# EasyEDA Pro project SCH_DRV8701 on Boosted Supply.eprj

# Schematic DRV8701 on Boosted Supply
Create Date: 2023-01-11; Page Name: DRIVIERDRV8701PCB; Project Name: SCH_DRV8701 on Boosted Supply; Schematic Name: DRV8701 on Boosted Supply; Update Date: 2023-01-11; Company: 嘉立创EDA; Page Size: B; Version: V1.0
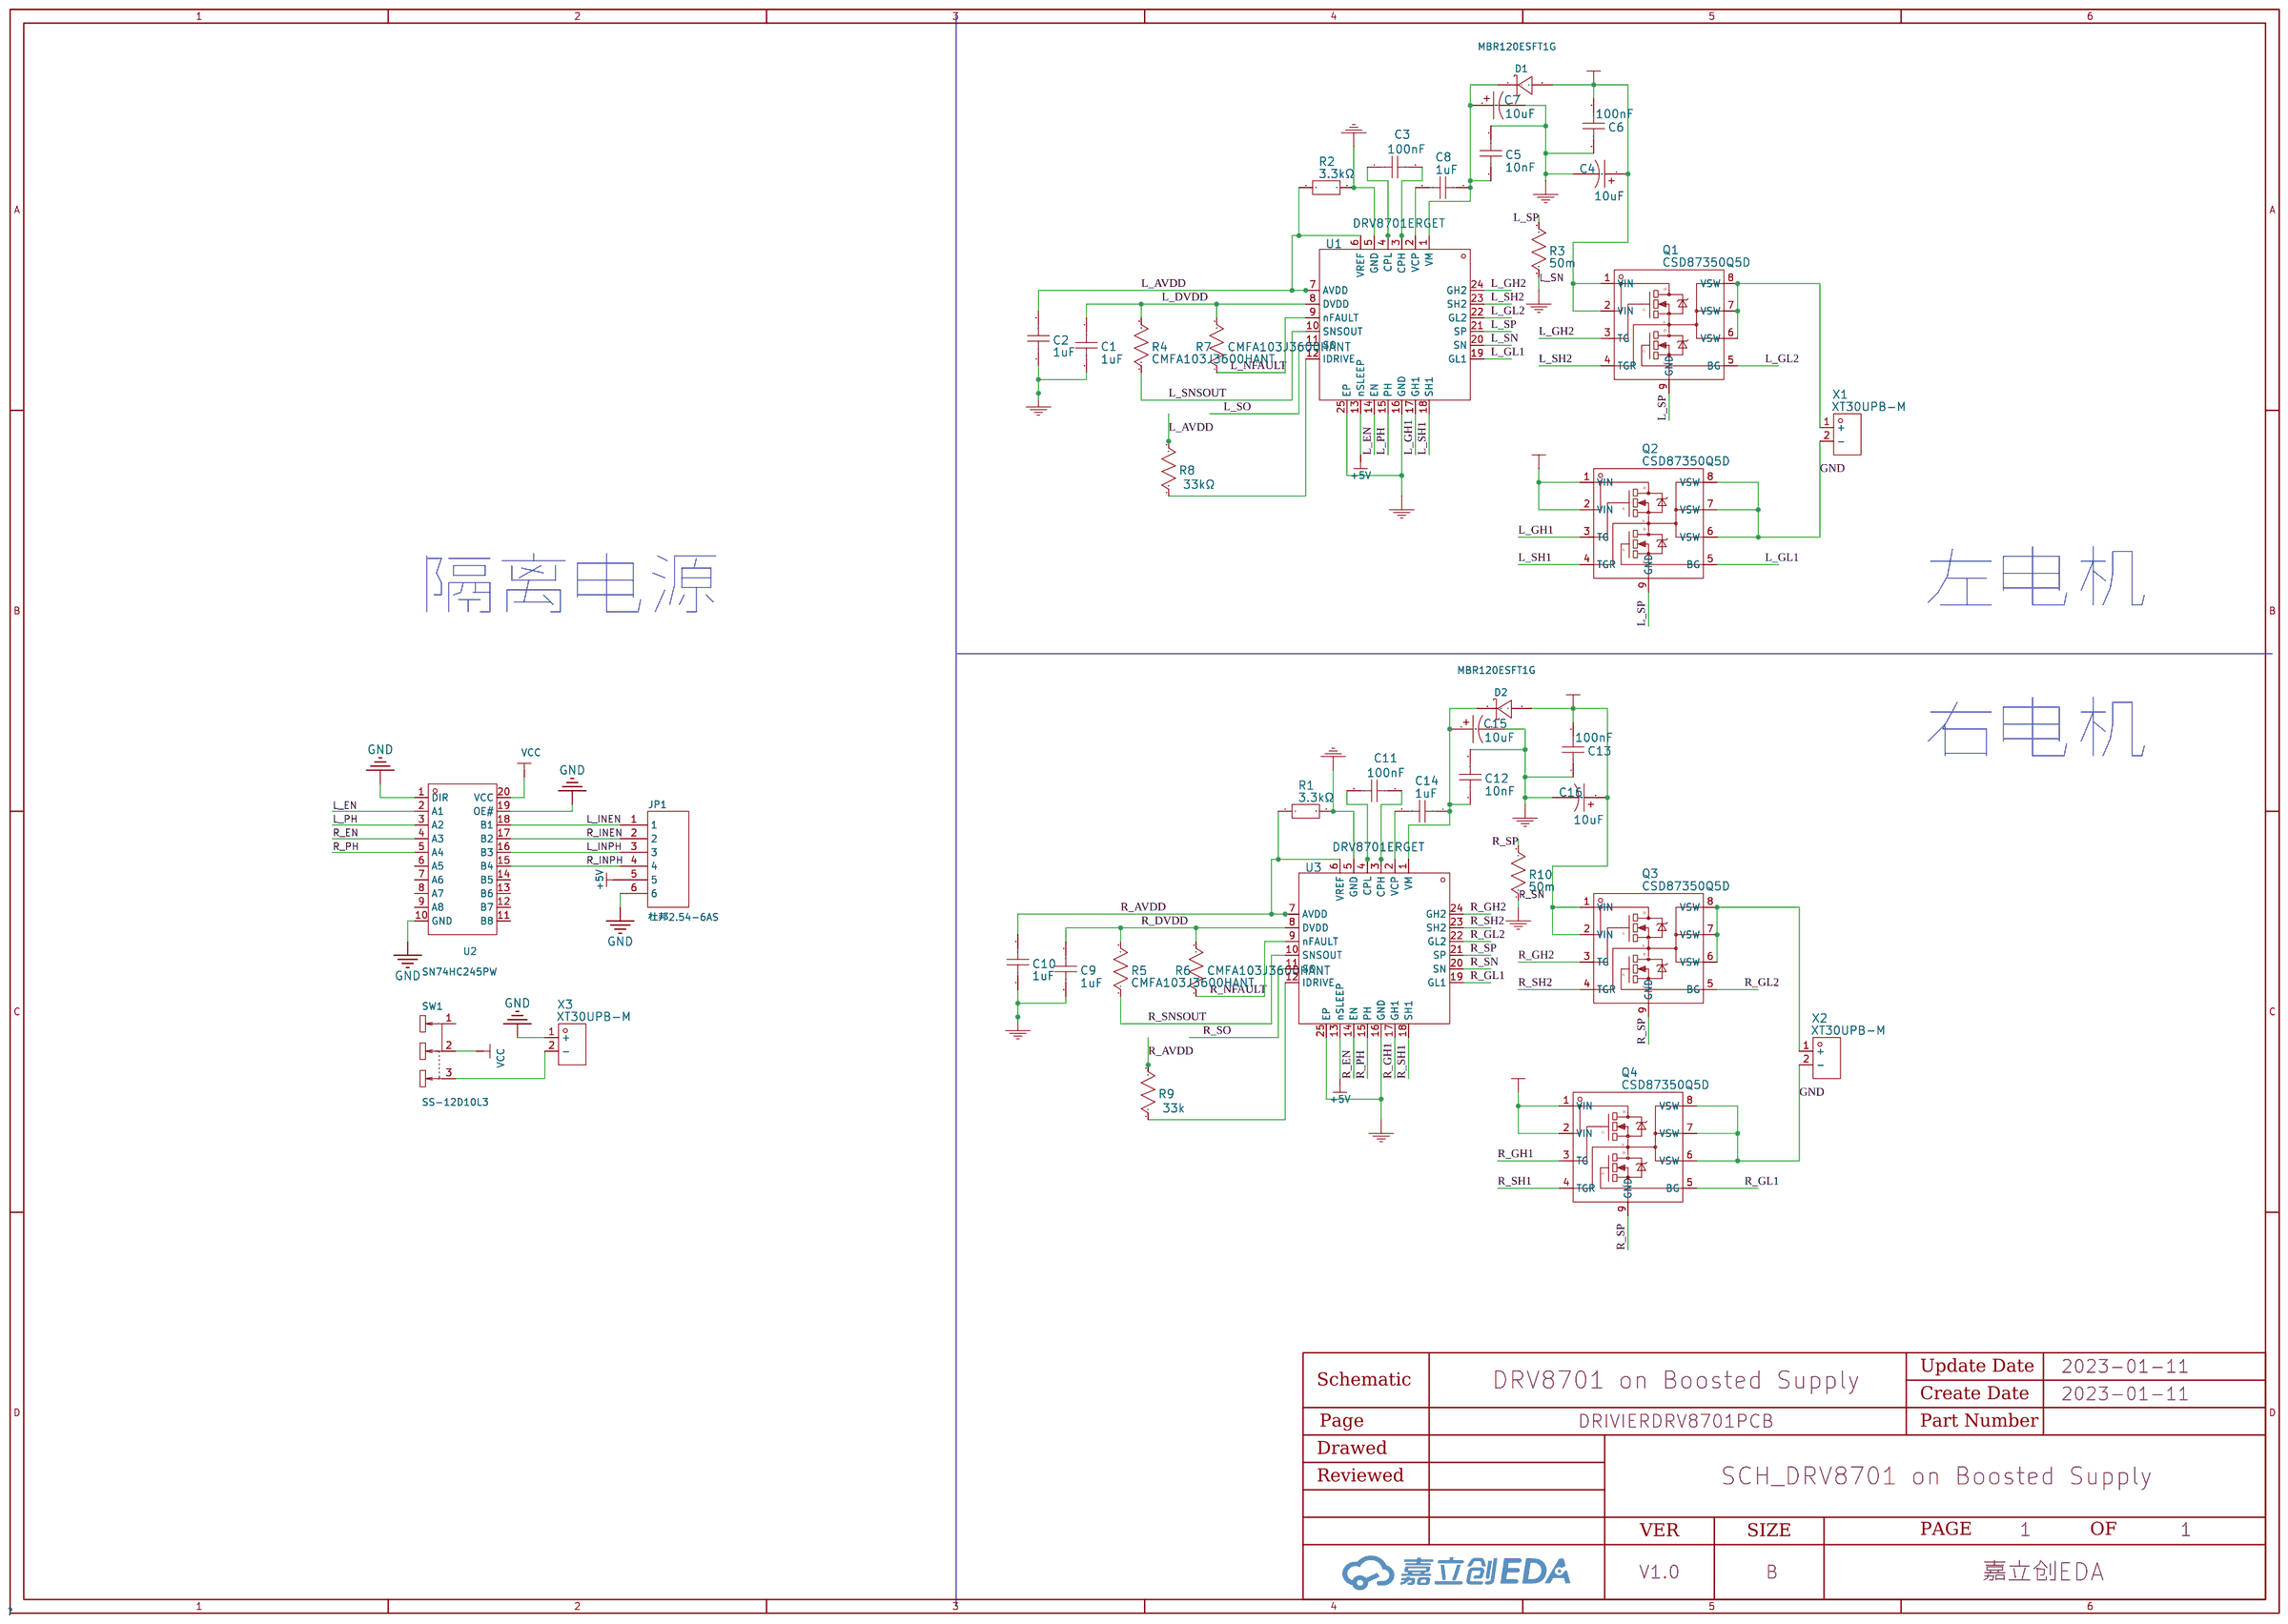
[diagram p0: schematic sheet]

## Parts
C1  1uF  [C0603]
C2  1uF  [C0603]
C3  100nF  [C0603]
C4  10uF  [CAP-TH_BD10.0-P5.00-D0.6-FD]
C5  10nF  [C0603]
C6  100nF  [C0603]
C7  10uF  [CAP-TH_BD10.0-P5.00-D0.6-FD]
C8  1uF  [C0603]
C9  1uF  [C0603]
C10  1uF  [C0603]
C11  100nF  [C0603]
C12  10nF  [C0603]
C13  100nF  [C0603]
C14  1uF  [C0603]
C15  10uF  [CAP-TH_BD10.0-P5.00-D0.6-FD]
C16  10uF  [CAP-TH_BD10.0-P5.00-D0.6-FD]
D1  MBR120ESFT1G  [SOD-123F_L2.7-W1.7-LS3.6-RD]
D2  MBR120ESFT1G  [SOD-123F_L2.7-W1.7-LS3.6-RD]
JP1  杜邦2.54-6AS  [CONN-TH_6P-P2.54_C50130]
Q1  CSD87350Q5D  [LSON-8_L6.0-W5.0-P1.27-LS6.0-TL-EP]
Q2  CSD87350Q5D  [LSON-8_L6.0-W5.0-P1.27-LS6.0-TL-EP]
Q3  CSD87350Q5D  [LSON-8_L6.0-W5.0-P1.27-LS6.0-TL-EP]
Q4  CSD87350Q5D  [LSON-8_L6.0-W5.0-P1.27-LS6.0-TL-EP]
R1  3.3kΩ  [RES-TH_BD4.0-L11.5-P15.50-D0.7]
R2  3.3kΩ  [RES-TH_BD4.0-L11.5-P15.50-D0.7]
R3  50m  [R0603]
R4  CMFA103J3600HANT  [R0603]
R5  CMFA103J3600HANT  [R0603]
R6  CMFA103J3600HANT  [R0603]
R7  CMFA103J3600HANT  [R0603]
R8  33kΩ  [RES-ARRAY-SMD_0804-8P-L2.0-W1.0-BL]
R9  33k  [R0603]
R10  50m  [R0603]
SW1  SS-12D10L3  [SW-TH_SS-12D10L3]
U1  DRV8701ERGET  [VQFN-24_L4.0-W4.0-P0.50-BL-EP2.5]
U2  SN74HC245PW  [TSSOP-20_L6.5-W4.4-P0.65-LS6.4-BL]
U3  DRV8701ERGET  [VQFN-24_L4.0-W4.0-P0.50-BL-EP2.5]
X1  XT30UPB-M  [CONN-TH_XT30UPB-M]
X2  XT30UPB-M  [CONN-TH_XT30UPB-M]
X3  XT30UPB-M  [CONN-TH_XT30UPB-M]

## Library data of the parts
C1 C2 C8-C10 C14 = CC0603KRX5R8BB105: 容值:1uF;精度:±10%;额定电压:25V;材质(温度系数):X5R;; LCSC Part Name: 1uF ±10% 25V; Supplier Part: C14664; Manufacturer: YAGEO(国巨); Supplier Footprint: 0603; JLCPCB Part Class: Extended Part; Datasheet: https://atta.szlcsc.com/upload/public/pdf/source/20160606/1465200209684.pdf; Supplier: LCSC; Tolerance: ±10%; Voltage Rated: 25V; Temperature Coefficient: X5R; Check: true
C3 C6 C11 C13 = CL10B104KB8NNNC: 容值:100nF;精度:±10%;额定电压:50V;材质(温度系数):X7R;; LCSC Part Name: 100nF ±10% 50V; Supplier Part: C1591; Manufacturer: SAMSUNG(三星); Supplier Footprint: 0603; JLCPCB Part Class: Extended Part; Datasheet: https://atta.szlcsc.com/upload/public/pdf/source/20160103/1457707680512.pdf; Supplier: LCSC; Tolerance: ±10%; Voltage Rated: 50V; Temperature Coefficient: X7R; Check: true
C4 C7 C15 C16 = LW100M2501017PV4: 容值:10uF;精度:±20%;额定电压:250V;电容体直径:10mm;电容体长度:20mm;脚间距:5mm;纹波电流:200mA@100kHz;等效串联电阻:4Ω@100kHz;工作寿命:2000hrs@105℃;工作温度:-40℃~+105℃;; LCSC Part Name: 10uF ±20% 250V 停产; Supplier Part: C2847239; Manufacturer: UNITED(怡德); Supplier Footprint: 直插,D10xL20mm; JLCPCB Part Class: Extended Part; Datasheet: https://atta.szlcsc.com/upload/public/pdf/source/20210723/C2847239_147AA3FCC1C7F46DE6816FDB6113BC95.pdf; Supplier: LCSC; Tolerance: ±20%; Rated Voltage: 250V; φD: 10mm; L: 20mm; Lead Spacing: 5mm; Ripple Current: 200mA@100kHz; Equivalent Series Resistance(ESR): 4Ω@100kHz; Lifetime @ Temp: 2000hrs@105℃; Operating Temperature: -40℃~+105℃; Check: true
C5 C12 = CT41G-0603-2X1-25V-0.01μF-K(N): 容值:10nF;精度:±10%;额定电压:25V;材质(温度系数):2X1;; LCSC Part Name: 10nF ±10% 25V; Supplier Part: C141383; Manufacturer: TORCH(火炬); Supplier Footprint: 0603; JLCPCB Part Class: Extended Part; Datasheet: https://atta.szlcsc.com/upload/public/pdf/source/20180326/C141383_03A7B12AFADEEDD421C5B2570CAE3F05.pdf; Supplier: LCSC; Tolerance: ±10%; Voltage Rated: 25V; Temperature Coefficient: 2X1; Check: true
D1 D2 = MBR120ESFT1G: 直流反向耐压(Vr):20V;平均整流电流(Io):1A;正向压降(Vf):530mV@1A;; Supplier Part: C236132; Manufacturer: onsemi(安森美); Supplier Footprint: SOD-123FL; JLCPCB Part Class: Extended Part; Datasheet: https://atta.szlcsc.com/upload/public/pdf/source/20181108/C236132_D79D04B82C34EDF35D87898709B4245F.pdf; Supplier: LCSC; Reverse Voltage (Vr): 20V; Average Rectified Current (Io): 1A; Forward Voltage (Vf@If): 530mV@1A; Check: true
JP1 = 杜邦2.54-6AS: 参考系列:-;间距:2.54mm;插针结构:1x6P;排数:1;每排PIN数:6;行距:-;安装方式:-;触头材质:黄铜;; LCSC Part Name: 2.54mm 1x6P; Supplier Part: C50130; Manufacturer: BOOMELE(博穆精密); Supplier Footprint: 插件,P=2.5mm; JLCPCB Part Class: Extended Part; Datasheet: https://atta.szlcsc.com/upload/public/pdf/source/20151208/1457707616522.pdf; Supplier: LCSC; Pitch: 2.54mm; Pins Structure: 1x6P; Number of Rows: 1; Number of PINs Per Row: 6; Contact Material: 黄铜; Check: true
Q1-Q4 = CSD87350Q5D: 类型:2个N沟道;漏源电压(Vdss):30V;连续漏极电流(Id):40A;功率(Pd):12W;导通电阻(RDS(on)@Vgs,Id):5.9mΩ@8V,20A;阈值电压(Vgs(th)@Id):2.1V@250uA;; LCSC Part Name: 2个N沟道 30V 40A; Supplier Part: C140356; Manufacturer: TI(德州仪器); Supplier Footprint: LSON-8(5x6); JLCPCB Part Class: Extended Part; Datasheet: https://atta.szlcsc.com/upload/public/pdf/source/20180326/C140356_1C911AD09D76D42F5E3D19E3B668112C.pdf; Supplier: LCSC; Type: 2个N沟道; Drain Source Voltage (Vdss): 30V; Continuous Drain Current (Id): 40A; Power Dissipation (Pd): 12W; Drain Source On Resistance (RDS(on)@Vgs,Id): 5.9mΩ@8V,20A; Gate Threshold Voltage (Vgs(th)@Id): 2.1V@250uA; Check: true
R1 R2 = MF1W-3.3KΩ±1% T: 电阻类型:金属膜电阻;阻值:3.3kΩ;精度:±1%;功率:1W;温度系数:±100ppm/℃;最大工作电压:350V;工作温度范围:-55℃~+155℃;; LCSC Part Name: 金属膜电阻 3.3kΩ ±1% 1W; Supplier Part: C119491; Manufacturer: CCO(千志电子); Supplier Footprint: 轴向引线,4.5x11.5mm; JLCPCB Part Class: Extended Part; Datasheet: https://atta.szlcsc.com/upload/public/pdf/source/20170718/C119491_1500346211692823147.pdf; Supplier: LCSC; Type: 金属膜电阻; Tolerance: ±1%; Power(Watts): 1W; Temperature Coefficient: ±100ppm/℃; Overload Voltage (Max): 350V; Operating Temperature Range: -55℃~+155℃; Check: true
R3 R10 = 50m: Check: false
R4-R7 = CMFA103J3600HANT: LCSC Part Name: 10kΩ ±5%; Supplier Part: C2976753; Manufacturer: FH(风华); Supplier Footprint: 0603; JLCPCB Part Class: Extended Part; Datasheet: https://atta.szlcsc.com/upload/public/pdf/source/20210728/C107464_1EC5A9420957424CF6525879D73B8579.pdf; Supplier: LCSC; Check: true
R8 = CAT10-333J4LF: 阻值:33kΩ;精度:±5%;单个元件功率:62.5mW;温度系数:±250ppm/℃;电阻器数:4;引脚数:8;; LCSC Part Name: 33kΩ ±5%; Supplier Part: C148516; Manufacturer: BOURNS; Supplier Footprint: 0402x4; JLCPCB Part Class: Extended Part; Datasheet: https://atta.szlcsc.com/upload/public/pdf/source/20171120/C148516_15111593514721130549.pdf; Supplier: LCSC; Tolerance: ±5%; Power(Watts): 62.5mW; Temperature Coefficient: ±250ppm/℃; Number of Resistors: 4; Number of Pins: 8; Check: true
R9 = 68k: Check: false
SW1 = SS-12D10L3: 额定电流(DC):3A;额定电压(DC):125V;额定电流(AC):3A;额定电压(AC):125V;电路结构:单刀双掷;安装方式:直插;机械寿命:10000;开关颜色:黑色;滑钮形状:矩形柱状;引脚样式:PC引脚;工作温度:-40℃~+85℃;开关长度:13mm;开关宽度:6.8mm;开关高度:6.4mm;; LCSC Part Name: 插件大电流拨动开关; Supplier Part: C319013; Manufacturer: XKB Connectivity(中国星坤); Supplier Footprint: 插件; JLCPCB Part Class: Extended Part; Datasheet: https://atta.szlcsc.com/upload/public/pdf/source/20211009/D6412F37AABE6F9459A6EE7FA4DAEADB.pdf; Supplier: LCSC; Current Rating (DC): 3A; Voltage Rating (DC): 125V; Current Rating (AC): 3A; Voltage Rating (AC): 125V; Circuit: 单刀双掷; Mounting Style: 直插; Mechanical Life: 10000; Actuator Color: 黑色; Actuator Style: 矩形柱状; Pin Style: PC引脚; Operating Temperature: -40℃~+85℃; Switch Length: 13mm; Switch Width: 6.8mm; Switch Height: 6.4mm; Check: true
U1 U3 = DRV8701ERGET: 电源电压:0V~5.5V;输出电流:-;接口:并行;; Supplier Part: C132049; Manufacturer: TI(德州仪器); Supplier Footprint: VQFN-24(4x4); JLCPCB Part Class: Extended Part; Datasheet: https://atta.szlcsc.com/upload/public/pdf/source/20170925/C132049_1506321643935990409.pdf; Supplier: LCSC; Type: 有刷直流电机; Supply Voltage: 0V~5.5V; Interface: 并行; Operating Temperature: -40℃~+125℃@(Ta); Check: true
U2 = SN74HC245PW: 具有三态输出的八路总线收发器 20-TSSOP -40 to 85; Supplier Part: C2871191; Manufacturer: TI(德州仪器); Supplier Footprint: TSSOP-20; JLCPCB Part Class: Extended Part; Supplier: LCSC; Check: true
X1-X3 = XT30UPB-M: Supplier Part: C428721; Manufacturer: AMASS(艾迈斯); JLCPCB Part Class: Extended Part; Datasheet: https://atta.szlcsc.com/upload/public/pdf/source/20190916/C428721_B0ECB8C5937139CEFE8736D2D3175B0E.pdf; Supplier: LCSC; link: https://item.szlcsc.com/100315.html; Check: true

## Nets
+5V: JP1.5 U1.13(nSLEEP) U3.13(nSLEEP)
GND: C1.2 C2.1 C4.2 C5.2 C6.1 C7.2 C9.2 C10.1 C12.2 C13.1 C15.2 C16.2 JP1.6 Q2.6(VSW) Q2.7(VSW) Q2.8(VSW) Q4.6(VSW) Q4.7(VSW) Q4.8(VSW) R1.2 R2.2 U1.5(GND) U1.16(GND) U1.25(EP) U2.1(DIR) U2.10(GND) U2.19(OE#) U3.5(GND) U3.16(GND) U3.25(EP) X1.2(-) X2.2(-) X3.1(+)
VBAT: C4.1 C6.2 C13.2 C16.1 D1.2(A) D2.2(A) Q1.1(VIN) Q1.2(VIN) Q2.1(VIN) Q2.2(VIN) Q3.1(VIN) Q3.2(VIN) Q4.1(VIN) Q4.2(VIN)
VCC: SW1.2 U2.20(VCC)
L_AVDD: C2.2 R2.1 R8.2 U1.6(VREF) U1.7(AVDD)
L_DVDD: C1.1 R4.2 R7.2 U1.8(DVDD)
L_EN: U1.14(EN) U2.2(A1)
L_GH1: Q2.3(TG) U1.17(GH1)
L_GH2: Q1.3(TG) U1.24(GH2)
L_GL1: Q2.5(BG) U1.19(GL1)
L_GL2: Q1.5(BG) U1.22(GL2)
L_INEN: JP1.1 U2.18(B1)
L_INPH: JP1.3 U2.16(B3)
L_NFAULT: R7.1 U1.9(nFAULT)
L_PH: U1.15(PH) U2.3(A2)
L_SH1: Q2.4(TGR) U1.18(SH1)
L_SH2: Q1.4(TGR) U1.23(SH2)
L_SN: R3.1 U1.20(SN)
L_SNSOUT: R4.1 U1.10(SNSOUT)
L_SO: U1.11(SO)
L_SP: Q1.9(GND) Q2.9(GND) R3.2 U1.21(SP)
R_AVDD: C10.2 R1.1 R9.2 U3.6(VREF) U3.7(AVDD)
R_DVDD: C9.1 R5.2 R6.2 U3.8(DVDD)
R_EN: U2.4(A3) U3.14(EN)
R_GH1: Q4.3(TG) U3.17(GH1)
R_GH2: Q3.3(TG) U3.24(GH2)
R_GL1: Q4.5(BG) U3.19(GL1)
R_GL2: Q3.5(BG) U3.22(GL2)
R_INEN: JP1.2 U2.17(B2)
R_INPH: JP1.4 U2.15(B4)
R_NFAULT: R6.1 U3.9(nFAULT)
R_PH: U2.5(A4) U3.15(PH)
R_SH1: Q4.4(TGR) U3.18(SH1)
R_SH2: Q3.4(TGR) U3.23(SH2)
R_SN: R10.1 U3.20(SN)
R_SNSOUT: R5.1 U3.10(SNSOUT)
R_SO: U3.11(SO)
R_SP: Q3.9(GND) Q4.9(GND) R10.2 U3.21(SP)
$1N94: C3.1 U1.4(CPL)
$1N95: C3.2 U1.3(CPH)
$1N105: C8.2 U1.2(VCP)
$1N139: R8.1 U1.12(IDRIVE)
$1N238: Q1.6(VSW) Q1.7(VSW) Q1.8(VSW) X1.1(+)
$1N2225: C5.1 C7.1 C8.1 D1.1(K) U1.1(VM)
$1N6642: R9.1 U3.12(IDRIVE)
$1N6643: C14.2 U3.2(VCP)
$1N6644: C11.1 U3.4(CPL)
$1N6647: C12.1 C14.1 C15.1 D2.1(K) U3.1(VM)
$1N6664: C11.2 U3.3(CPH)
$1N6665: Q3.6(VSW) Q3.7(VSW) Q3.8(VSW) X2.1(+)
$1N13007: SW1.3 X3.2(-)

Not connected (* = marked no-connect by the designer): SW1 1; U2 6(A5) 7(A6) 8(A7) 9(A8) 11(B8) 12(B7) 13(B6) 14(B5)

## Notes on the sheet
- 左电机
- 隔离电源
- 右电机

# Schematic DRV8701 on Boosted Supply_1
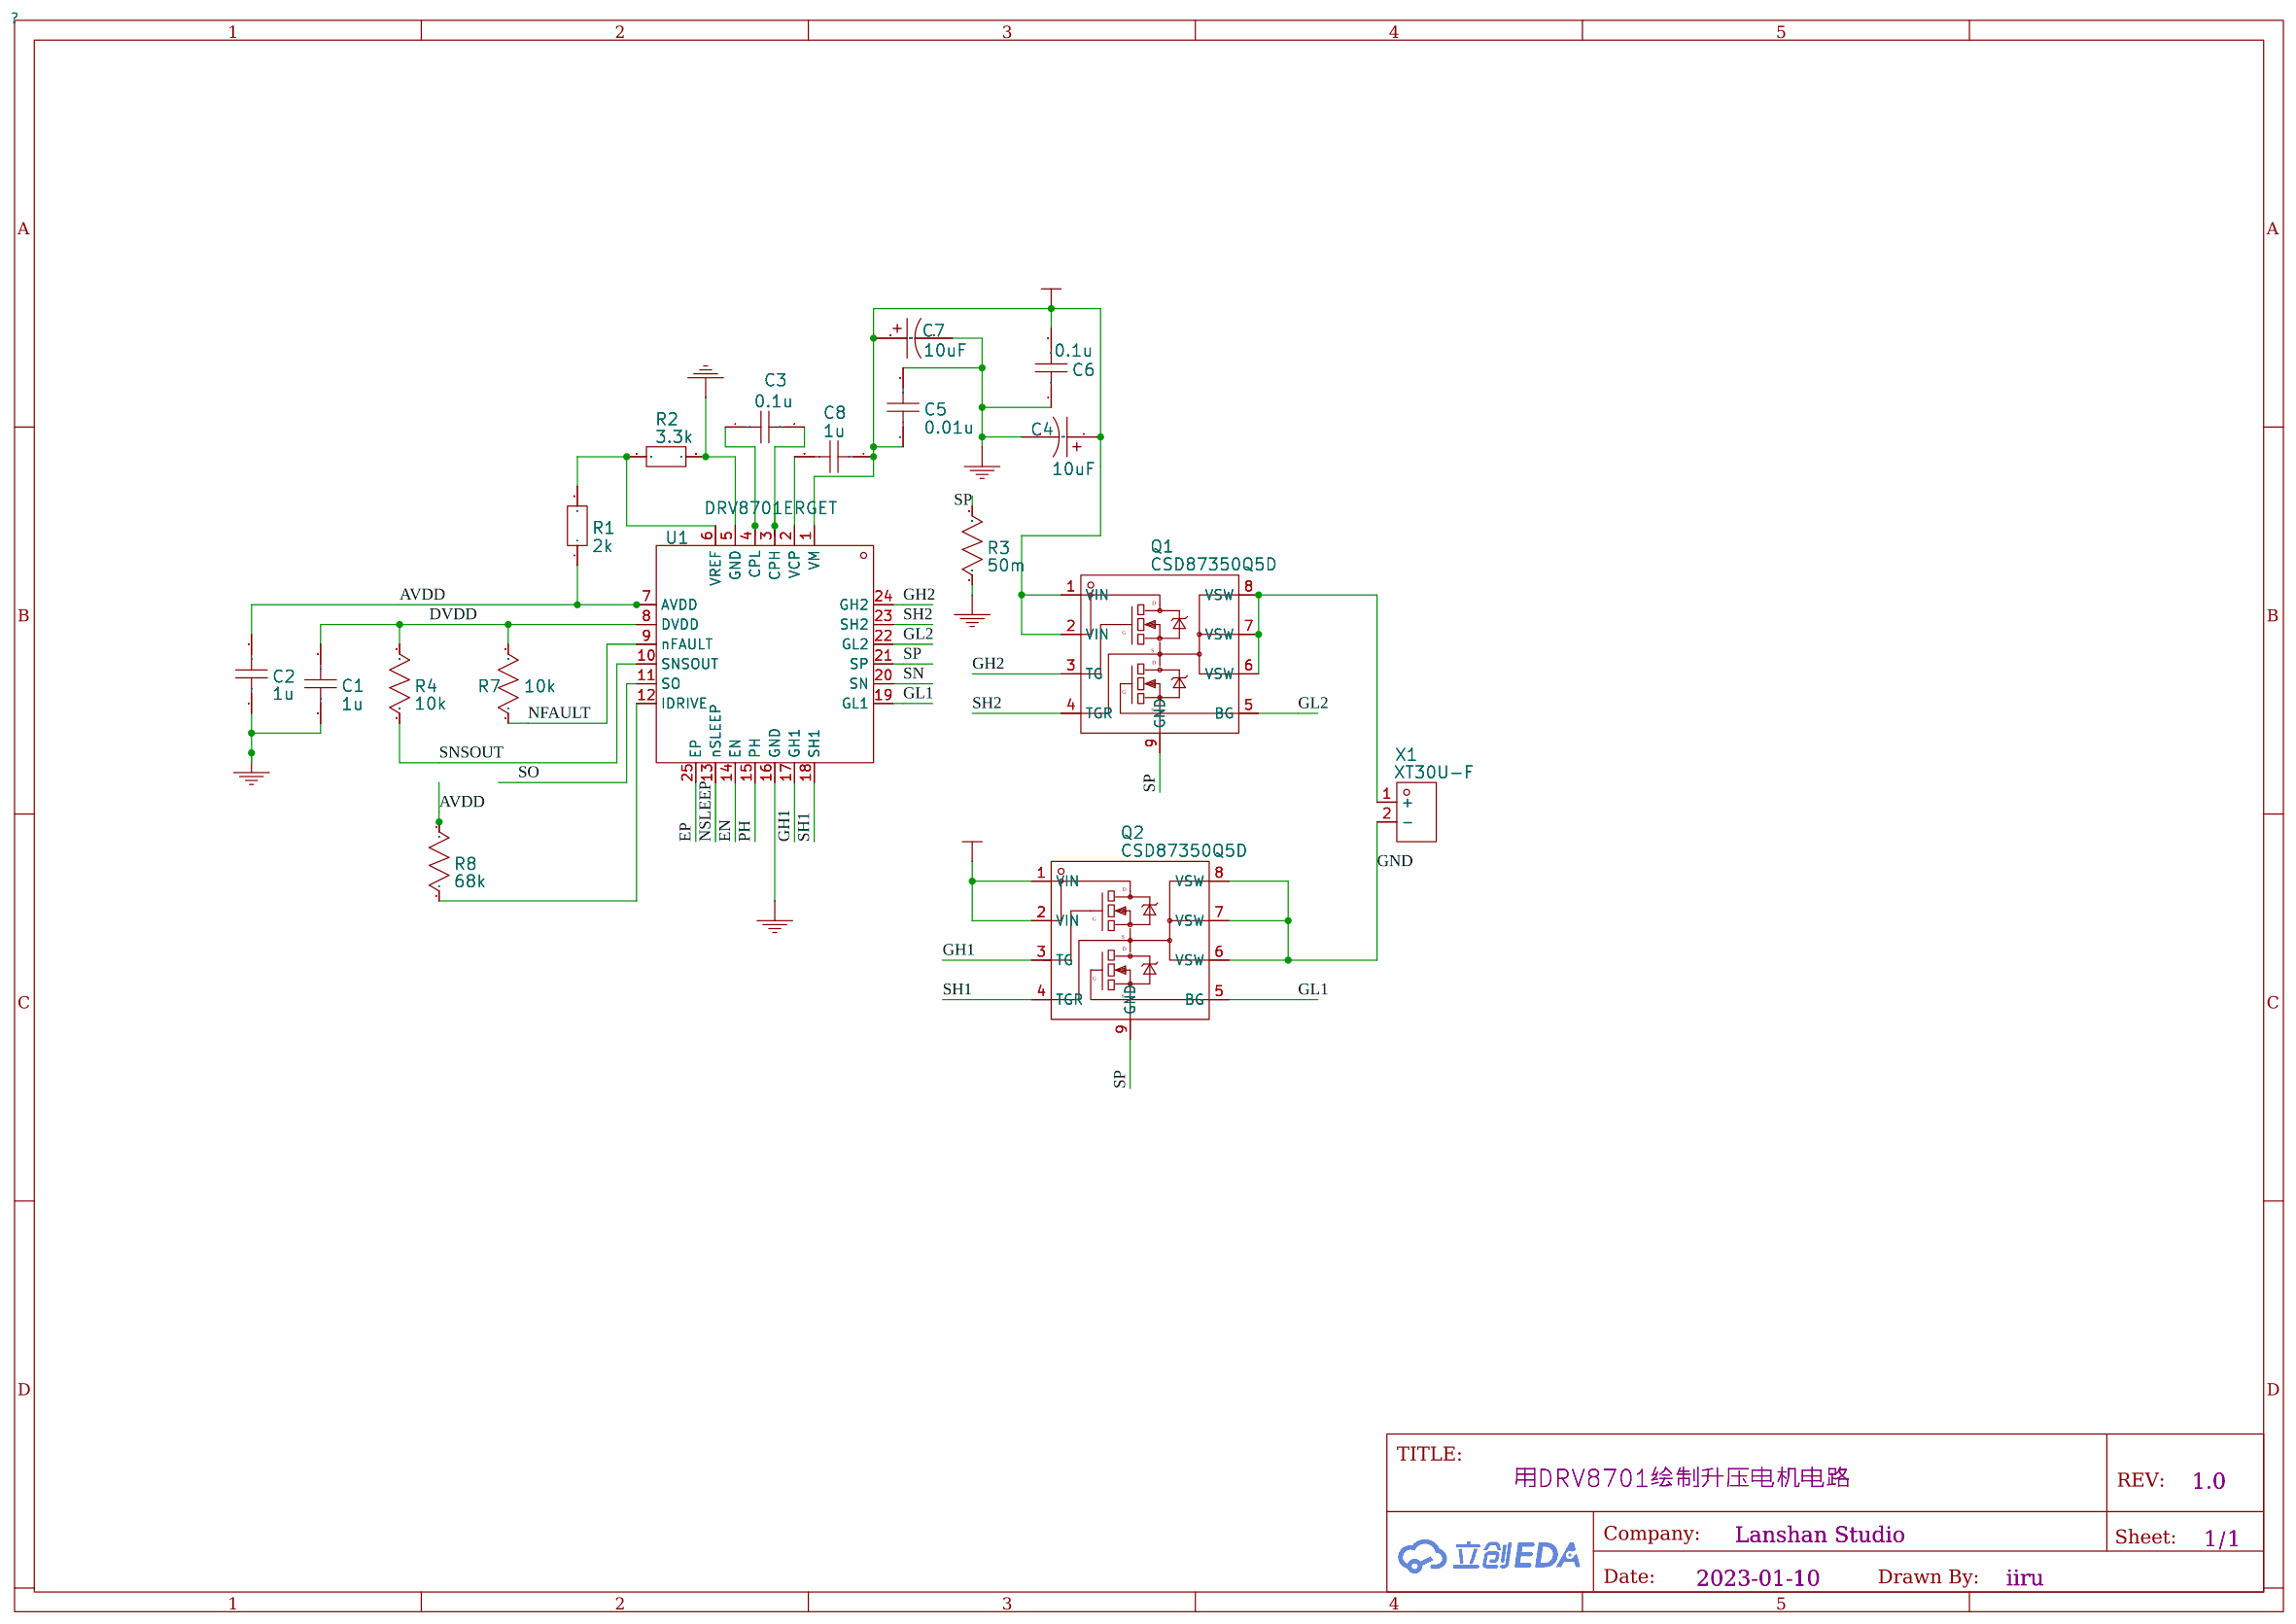
[diagram p1: schematic sheet]

## Parts
C1  1u
C2  1u
C3  0.1u
C4  10uF
C5  0.01u
C6  0.1u
C7  10uF
C8  1u
Q1  CSD87350Q5D
Q2  CSD87350Q5D
R1  2k
R2  3.3k
R3  50m
R4  10k
R7  10k
R8  68k
U1  DRV8701ERGET
X1  XT30U-F

## Library data of the parts
C1 C2 C8 = 1u
C3 C6 = 0.1u
C4 C7 = 10uF
C5 = 0.01u
Q1 Q2 = CSD87350Q5D: Supplier: LCSC; Supplier Part: C140356; Manufacturer: TI(德州仪器); JLCPCB Part Class: Extended Part
R1 = 2k
R2 = 3.3k
R3 = 50m
R4 R7 = 10k
R8 = 68k
U1 = DRV8701ERGET: Supplier: LCSC; Manufacturer: TI(德州仪器); Supplier Part: C132049; JLCPCB Part Class: Extended Part
X1 = XT30U-F: Manufacturer: AMASS(艾迈斯); Supplier Part: C99102; Supplier: LCSC; link: https://item.szlcsc.com/100315.html

## Nets
AVDD: C2.2 R1.1 R8.2 U1.7(AVDD)
DVDD: C1.1 R4.2 R7.2 U1.8(DVDD)
GND: C1.2 C2.1 C4.2 C5.2 C6.1 C7.2 Q2.6(VSW) Q2.7(VSW) Q2.8(VSW) R2.2 R3.1 U1.5(GND) U1.16(GND) X1.2(-)
VBAT: C4.1 C5.1 C6.2 C7.1 C8.1 Q1.1(VIN) Q1.2(VIN) Q2.1(VIN) Q2.2(VIN) U1.1(VM)
EN: U1.14(EN)
EP: U1.25(EP)
GH1: Q2.3(TG) U1.17(GH1)
GH2: Q1.3(TG) U1.24(GH2)
GL1: Q2.5(BG) U1.19(GL1)
GL2: Q1.5(BG) U1.22(GL2)
NFAULT: R7.1 U1.9(nFAULT)
NSLEEP: U1.13(nSLEEP)
PH: U1.15(PH)
SH1: Q2.4(TGR) U1.18(SH1)
SH2: Q1.4(TGR) U1.23(SH2)
SN: U1.20(SN)
SNSOUT: R4.1 U1.10(SNSOUT)
SO: U1.11(SO)
SP: Q1.9(GND) Q2.9(GND) R3.2 U1.21(SP)
Net-(C3-1): C3.1 U1.4(CPL)
Net-(C3-2): C3.2 U1.3(CPH)
Net-(C8-2): C8.2 U1.2(VCP)
Net-(Q1-6): Q1.6(VSW) Q1.7(VSW) Q1.8(VSW) X1.1(+)
Net-(R1-2): R1.2 R2.1 U1.6(VREF)
Net-(R8-1): R8.1 U1.12(IDRIVE)

# Board PCB1
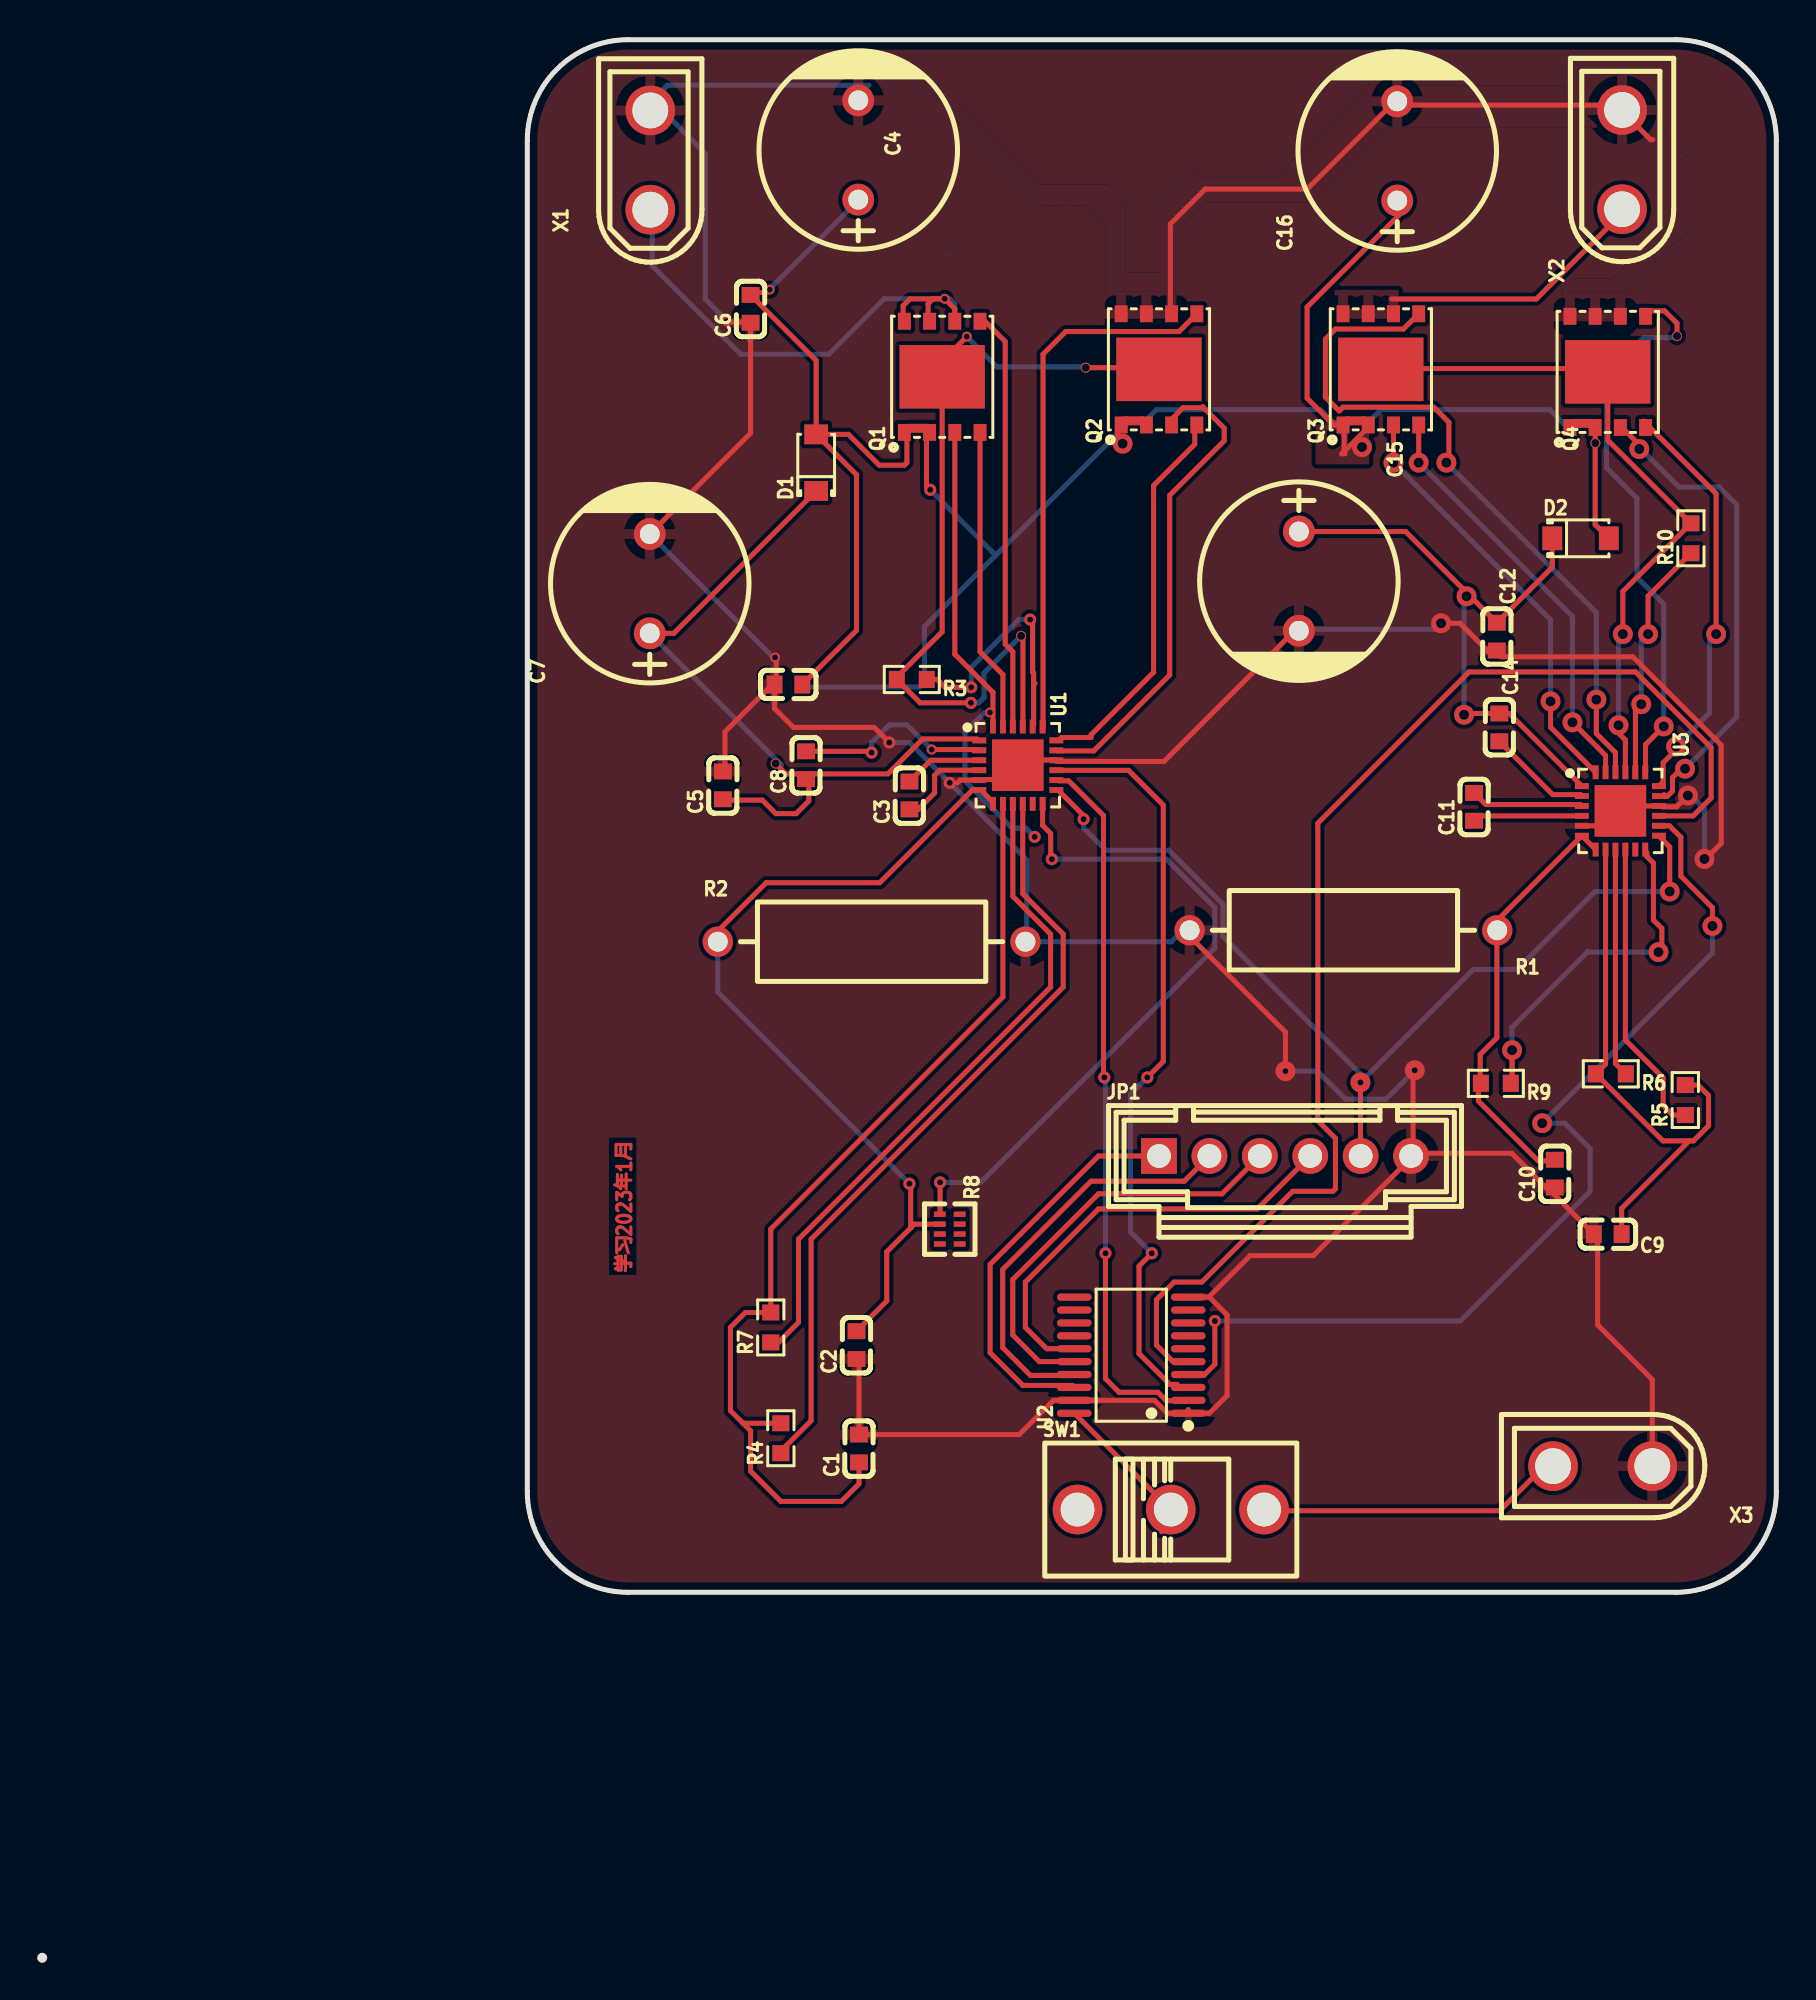
[diagram p2: board, top side]
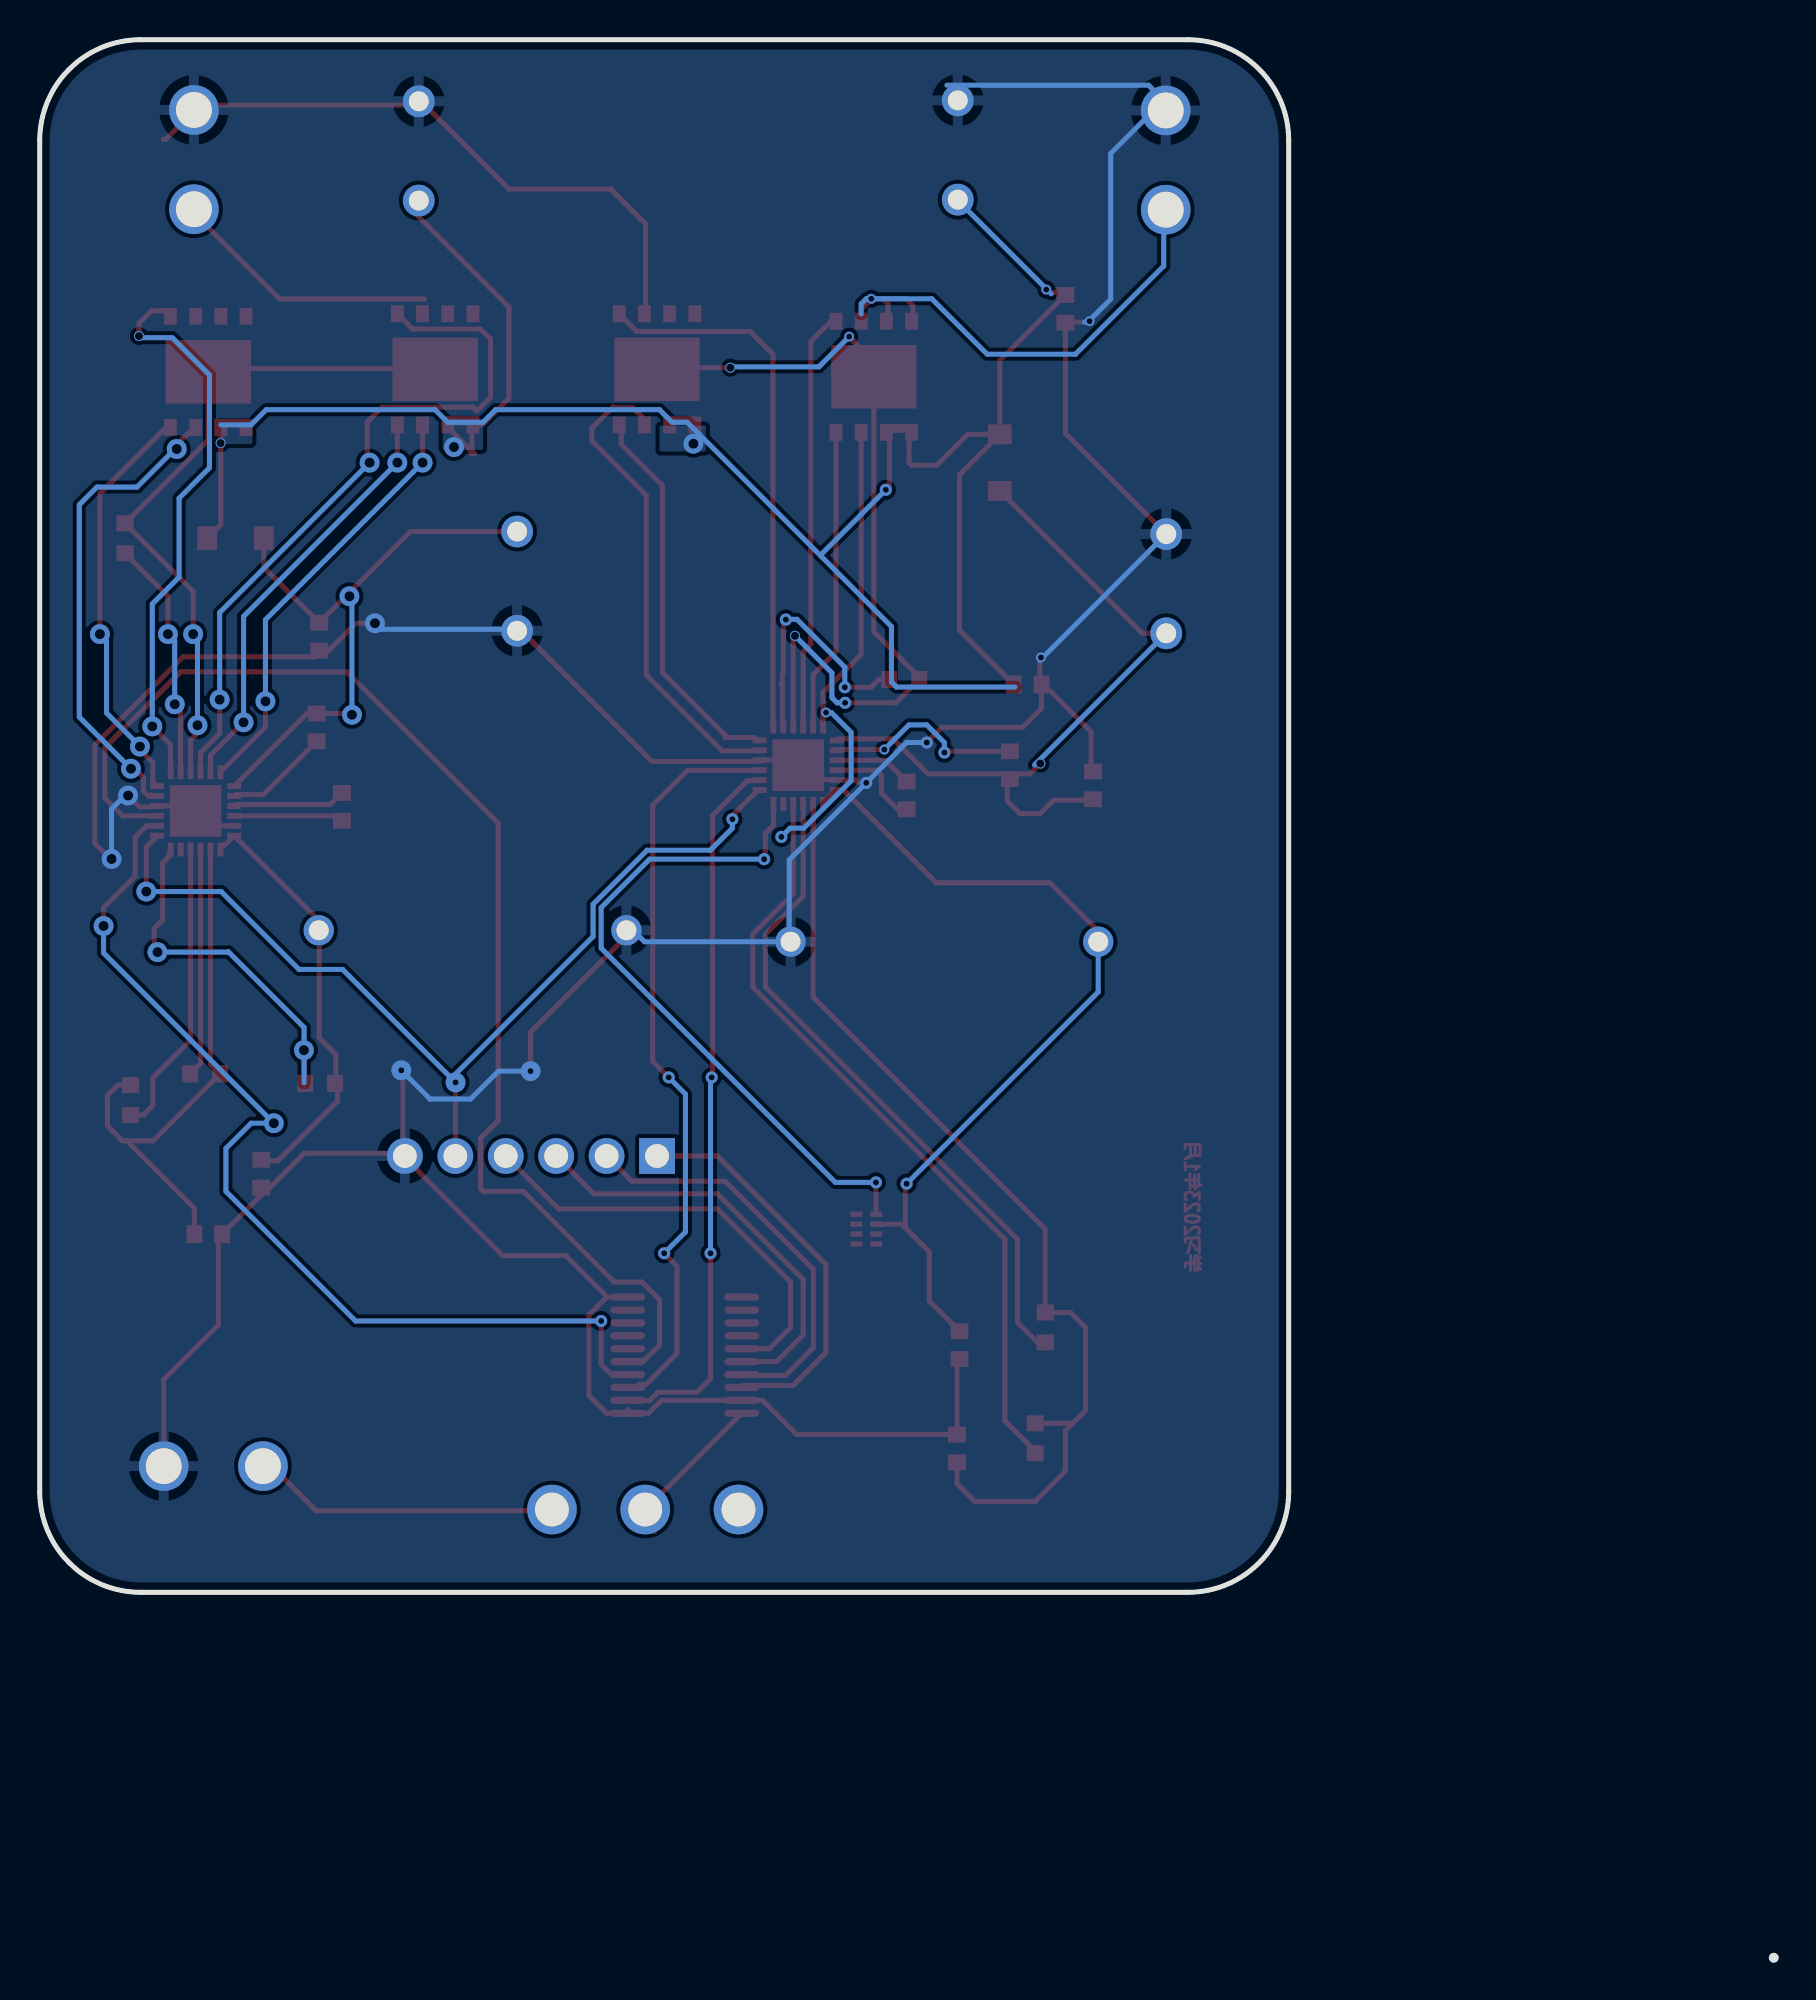
[diagram p3: board, bottom side, seen from below]

Outline 87.49 x 96.74 mm; copper layers: Top Layer, Bottom Layer. Coordinates in mm from the lower left corner of the outline.
Outline path: circle c0.13,0.13 r0.13 ; 24.56,91.66 arc(26.05,95.25) 29.64,96.74 82.41,96.74 arc(86,95.25) 87.49,91.66 87.49,23.62 arc(86,20.02) 82.41,18.54 29.64,18.54 arc(26.05,20.02) 24.56,23.62 24.56,91.66
Stack: Top Layer 0.035mm / Dielectric1 1.51mm FR4 er 4.5 / Bottom Layer 0.035mm

## Design rules (mm)
spacing safeClearance (default): track to track 0.152, other pairs 0.152 to 0.3
track width trackWidth (default): min 0.127, default 0.254, max 2.54
differential pair differentialPair (default): width min 0.127, default 0.254, max 2.54; gap min 0.152, default 0.152
via viaSize (default): diameter min 0.5, default 0.61, max 10; hole min 0.3, default 0.305, max 6

## Placement (name value [footprint] x y rotation side)
C1  1uF  [C0603]  41.27 25.78 90 top
C2  1uF  [C0603]  41.15 30.99 90 top
C3  100nF  [C0603]  43.81 58.67 90 top
C4  10uF  [CAP-TH_BD10.0-P5.00-D0.6-FD]  41.24 91.19 90 top
C5  10nF  [C0603]  34.42 59.18 90 top
C6  100nF  [C0603]  35.81 83.18 90 top
C7  10uF  [CAP-TH_BD10.0-P5.00-D0.6-FD]  30.73 69.34 90 top
C8  1uF  [C0603]  38.61 60.2 90 top
C9  1uF  [C0603]  78.99 36.58 180 top
C10  1uF  [C0603]  76.33 39.62 90 top
C11  100nF  [C0603]  72.26 58.1 90 top
C12  10nF  [C0603]  73.41 66.67 270 top
C13  100nF  [C0603]  37.72 64.26 0 top
C14  1uF  [C0603]  73.53 62.1 270 top
C15  10uF  [CAP-TH_BD10.0-P5.00-D0.6-FD]  63.43 69.47 270 top
C16  10uF  [CAP-TH_BD10.0-P5.00-D0.6-FD]  68.39 91.14 90 top
D1  MBR120ESFT1G  [SOD-123F_L2.7-W1.7-LS3.6-RD]  39.12 75.44 90 top
D2  MBR120ESFT1G  [SOD-123F_L2.7-W1.7-LS3.6-RD]  77.62 71.63 0 top
JP1  杜邦2.54-6AS  [CONN-TH_6P-P2.54_C50130]  62.74 40.51 0 top
Q1  CSD87350Q5D  [LSON-8_L6.0-W5.0-P1.27-LS6.0-TL-EP]  45.47 79.76 90 top
Q2  CSD87350Q5D  [LSON-8_L6.0-W5.0-P1.27-LS6.0-TL-EP]  56.39 80.14 90 top
Q3  CSD87350Q5D  [LSON-8_L6.0-W5.0-P1.27-LS6.0-TL-EP]  67.57 80.14 90 top
Q4  CSD87350Q5D  [LSON-8_L6.0-W5.0-P1.27-LS6.0-TL-EP]  79 80.01 90 top
R1  3.3kΩ  [RES-TH_BD4.0-L11.5-P15.50-D0.7]  65.68 51.88 180 top
R2  3.3kΩ  [RES-TH_BD4.0-L11.5-P15.50-D0.7]  41.91 51.31 0 top
R3  50m  [R0603]  43.93 64.52 180 top
R4  CMFA103J3600HANT  [R0603]  37.34 26.3 90 top
R5  CMFA103J3600HANT  [R0603]  82.9 43.33 90 top
R6  CMFA103J3600HANT  [R0603]  79.15 44.65 180 top
R7  CMFA103J3600HANT  [R0603]  36.83 31.88 90 top
R8  33kΩ  [RES-ARRAY-SMD_0804-8P-L2.0-W1.0-BL]  45.85 36.83 270 top
R9  33k  [R0603]  73.36 44.17 180 top
R10  50m  [R0603]  83.18 71.63 90 top
SW1  SS-12D10L3  [SW-TH_SS-12D10L3]  56.98 22.7 0 top
U1  DRV8701ERGET  [VQFN-24_L4.0-W4.0-P0.50-BL-EP2.5]  49.27 60.2 270 top
U2  SN74HC245PW  [TSSOP-20_L6.5-W4.4-P0.65-LS6.4-BL]  54.99 30.48 90 top
U3  DRV8701ERGET  [VQFN-24_L4.0-W4.0-P0.50-BL-EP2.5]  79.63 57.89 270 top
X1  XT30UPB-M  [CONN-TH_XT30UPB-M]  30.76 90.68 90 top
X2  XT30UPB-M  [CONN-TH_XT30UPB-M]  79.72 90.7 90 top
X3  XT30UPB-M  [CONN-TH_XT30UPB-M]  78.74 24.89 180 top

## Footprints (pads in the part's own frame, mm; a bottom-side part is the same pattern mirrored in y, then rotated)
C0603
  rect 0.8x0.9 smd: 1(-0.7,0) 2(0.7,0)
CAP-TH_BD10.0-P5.00-D0.6-FD
  round 1.6 hole 1: 1(-2.5,0) 2(2.5,0)
CONN-TH_6P-P2.54_C50130
  rect 1.801x1.801 hole 1.199: 1(-6.35,0)
  round 1.801 hole 1.199: 2(-3.81,0) 3(-1.27,0) 4(1.27,0) 5(3.81,0) 6(6.35,0)
CONN-TH_XT30UPB-M
  round 2.499 hole 1.801: 1(-2.499,0) 2(2.499,0)
LSON-8_L6.0-W5.0-P1.27-LS6.0-TL-EP
  rect 0.85x0.65 smd: 1(-2.8,1.905) 2(-2.8,0.635) 3(-2.8,-0.635) 4(-2.8,-1.905) 5(2.8,-1.905) 6(2.8,-0.635) 7(2.8,0.635) 8(2.8,1.905)
  rect 0.45x1 smd: 1(-2.594,1.27)
  rect 3.2x4.3 smd: 9(0,0.002)
R0603
  rect 0.806x0.864 smd: 1(-0.753,0) 2(0.753,0)
RES-ARRAY-SMD_0804-8P-L2.0-W1.0-BL
  rect 0.275x0.6 smd: 1(-0.75,-0.5) 2(-0.249,-0.5) 3(0.249,-0.5) 4(0.75,-0.5) 5(0.75,0.5) 6(0.249,0.5) 7(-0.249,0.5) 8(-0.75,0.5)
RES-TH_BD4.0-L11.5-P15.50-D0.7
  round 1.524 hole 1.001: 1(-7.75,0) 2(7.75,0)
SOD-123F_L2.7-W1.7-LS3.6-RD
  rect 1.001x1.199 smd: 1(-1.425,0) 2(1.425,0)
SW-TH_SS-12D10L3
  round 2.499 hole 1.7: 1(-4.699,0) 2(0,0) 3(4.699,0)
TSSOP-20_L6.5-W4.4-P0.65-LS6.4-BL
  oval 0.364x1.742 smd: 1(-2.925,-2.871) 2(-2.275,-2.871) 3(-1.625,-2.871) 4(-0.975,-2.871) 5(-0.325,-2.871) 6(0.325,-2.871) 7(0.975,-2.871) 8(1.625,-2.871) 9(2.275,-2.871) 10(2.925,-2.871) 11(2.925,2.871) 12(2.275,2.871) 13(1.625,2.871) 14(0.975,2.871) 15(0.325,2.871) 16(-0.325,2.871) 17(-0.975,2.871) 18(-1.625,2.871) 19(-2.275,2.871) 20(-2.925,2.871)
VQFN-24_L4.0-W4.0-P0.50-BL-EP2.5
  rect 0.3x0.7 smd: 1(-1.25,-1.942) 2(-0.75,-1.942) 3(-0.25,-1.942) 4(0.25,-1.942) 5(0.75,-1.942) 6(1.25,-1.942) 13(1.25,1.942) 14(0.75,1.942) 15(0.25,1.942) 16(-0.25,1.942) 17(-0.75,1.942) 18(-1.25,1.942)
  rect 0.7x0.3 smd: 7(1.948,-1.25) 8(1.948,-0.75) 9(1.948,-0.25) 10(1.948,0.25) 11(1.948,0.75) 12(1.948,1.25) 19(-1.948,1.25) 20(-1.948,0.75) 21(-1.948,0.25) 22(-1.948,-0.25) 23(-1.948,-0.75) 24(-1.948,-1.25)
  rect 2.6x2.6 smd: 25(0.001,-0.001)

## Nets
As in the schematic.

Pads without a net: R8 3 4 5 6 7 8; SW1 1; U2 6 7 8 9 11 12 13 14

## Via types
v1: diameter 0.5, hole 0.3, Top Layer to Bottom Layer, 6 vias
v2: diameter 1.001, hole 0.305, Top Layer to Bottom Layer, 2 vias
v3: diameter 1.001, hole 0.508, Top Layer to Bottom Layer, 27 vias
v4: diameter 1.001, hole 0.3, Top Layer to Bottom Layer, 1 via
v5: diameter 0.61, hole 0.305, Top Layer to Bottom Layer, 17 vias
v6: diameter 0.508, hole 0.406, Top Layer to Bottom Layer, 5 vias
v7: diameter 0.508, hole 0.305, Top Layer to Bottom Layer, 1 via

## Routing (per net, layer and track width the routed paths; a pad name or vN(x,y) marks a point on that pad's centre or on a via; arc(x,y) is an arc through that point)
+5V: length 48.6
  Top Layer w0.254: v2(66.54,44.22) 66.54,40.64 66.46,40.56 ; 51.39,58.86 52.59,57.66 v5(52.59,57.48) ; 81.67,56.53 82.12,56.08 v3(82.12,53.83)
  Bottom Layer w0.254: v3(82.12,53.83) 78.34,53.83 74.42,49.91 72.23,49.91 v2(66.54,44.22) ; v5(52.59,57.48) 52.59,57.03 53.7,55.91 56.89,55.91 59.61,53.19 59.61,51.57 66.62,44.55
GND: length 261.3
  Top Layer w0.254: 81.75,58.1 82.46,58.1 v3(83.03,58.67) ; U3.16 79.88,58.14 U3.25 78.88,57.14 U3.5 ; U2.1 58.92,27.55 59.82,28.45 59.82,32.51 58.92,33.4 U2.10 ; U2.1 56.81,27.55 56.16,28.2 U2.19 51.07,28.2 49.35,26.48 C1.2 41.27,30.16 C2.1 ; U2.1 57.86,27.74 ; U1.5 46.37,59.45 46.23,59.31 ; 47.51,59.48 48.59,59.48 49.34,60.22 ; 49.63,60.28 50.33,60.28 50.52,60.46 51.19,60.46 51.2,60.45 ; 35.82,82.52 34.65,82.52 v1(34.6,82.57) ; C7.2 35.81,76.92 C6.1 ; 37.1,65.63 37.1,64.46 34.52,61.88 34.52,59.95 34.58,59.89 ; 69.27,40.65 74.15,40.65 75.96,38.85 ; 54.5,82.77 54.67,82.94 Q2.8 ; 79.74,93.45 79.94,93.45 79.97,93.48 ; 79.74,93.45 68.48,93.45 ; 79.74,93.45 79.65,93.54 ; 73.12,65.78 71.55,67.35 v3(70.6,67.35) ; v5(42.8,61.34) 42.04,62.1 37.97,62.1 37.02,63.06 C13.1 ; X3.1 81.24,29.25 78.49,32 78.49,36.38 C9.2 76.33,38.54 C10.1 ; 81.27,91.71 81.15,91.71 79.79,93.07 ; 63.52,67.27 56.64,60.39 51.23,60.39 ; 58.04,51.47 62.76,46.75 v4(62.76,44.79) ; 56.96,83.01 56.96,87.46 58.72,89.22 63.85,89.22 68.1,93.47 ; 69.2,40.72 69.2,40.54 64.16,35.49 60.98,35.49 59,33.51 ; 73.6,65.66 80.26,65.66 84.71,61.21 84.71,56.26 83.92,55.48 v3(83.87,55.48) ; v2(69.27,44.83) 69.19,44.75 69.19,41.31
  Bottom Layer w0.254: 63.74,67.04 70.29,67.04 v3(70.6,67.35) ; C7.2 37.08,65.49 37.08,65.55 ; 41.78,94.45 31.62,94.45 30.86,93.69 33.53,91.02 33.53,83.68 34.69,82.52 34.84,82.52 ; v3(83.87,55.48) 83.87,57.99 83.06,58.8 ; 49.73,51.42 49.73,55.43 v5(45.85,59.31) 43.81,61.34 v5(42.8,61.34) ; 57.74,52.03 57.01,51.3 49.83,51.3 ; v2(69.27,44.83) 67.82,43.38 65.78,43.38 64.37,44.79 v4(62.76,44.79)
  vias: v1(37.05,65.63)
VBAT: length 117.5
  Top Layer w0.254: 43.56,77.21 43.69,77.08 43.69,75.44 43.56,75.31 42.29,75.31 40.74,76.86 D1.2 ; D2.2 78.36,72.32 Q4.2 ; 65.71,77.23 65.71,76 ; 65.71,76 65.59,75.88 65.76,75.88 ; 65.71,76 66.9,77.19 ; 65.81,77.33 65.2,77.33 63.85,78.68 63.85,83.28 68.78,88.2 ; C13.2 41.15,66.99 41.15,74.83 D1.2 ; D1.2 39.12,80.58 C6.2 ; 35.86,84.01 36.63,84.01 v1(36.78,84.16) ; 54.31,77.18 54.31,76.64 v3(54.55,76.39) ; 44.67,76.7 44.67,74.26 v5(44.86,74.07)
  Bottom Layer w0.254: v5(44.86,74.07) 48.13,70.8 48.13,70.73 ; 48.13,70.73 44.58,67.18 44.58,64.39 44.32,64.13 38.35,64.13 ; 48.13,70.73 54.86,77.47 55.63,77.47 56.26,78.1 64.52,78.1 65.15,77.47 66.93,77.47 67.56,78.1 76.07,78.1 76.83,77.34 78.36,77.34 ; 36.53,83.94 41.27,88.69
  vias: v3(66.62,76.22) v6(78.37,76.42)
VCC: length 7.8
  Top Layer w0.254: U2.20 56.52,23.16 56.52,21.59
L_AVDD: length 43.3
  Top Layer w0.254: 43.88,36.89 42.67,35.69 42.67,33.21 C2.2 ; 43.88,36.89 44.06,37.08 R8.2 ; 43.88,36.89 43.88,39.05 v5(43.81,39.12) ; 34.15,51.84 36.6,54.28 42.32,54.28 46.98,58.94 47.44,58.94 ; 47.48,58.88 48,58.36 48,58.34
  Bottom Layer w0.254: v5(43.81,39.12) 34.16,48.77 R2.1
L_DVDD: length 49.9
  Top Layer w0.254: 35.43,27.05 34.8,27.69 34.8,31.88 35.55,32.63 R7.2 36.83,36.83 48.52,48.52 U1.8 ; 35.43,27.05 R4.2 ; 35.43,27.05 35.81,26.67 35.81,24.64 37.34,23.11 40.39,23.11 41.27,24 C1.1
L_EN: length 35.6
  Top Layer w0.254: v5(53.69,35.61) 53.69,29.3 54.38,28.61 56.33,28.61 56.75,28.19 57.43,28.19 ; v5(53.63,44.47) 53.59,44.51 53.59,57.66 51.84,59.41 51.32,59.41
  Bottom Layer w0.254: v5(53.63,44.47) 53.69,44.41 v5(53.69,35.61)
L_GH1: length 24.5
  Top Layer w0.254: 56.93,77.35 56.93,77.53 57.6,78.21 58.55,78.21 58.59,78.25 59.67,77.17 59.67,76.54 56.93,73.79 56.93,64.74 53.1,60.92 51.26,60.92
L_GH2: length 24.7
  Top Layer w0.254: 46.1,65.79 48.02,63.86 U1.24 ; 46.1,77.21 46.1,65.79
  Bottom Layer w0.254: 47.94,62.83 47.93,62.84 47.6,62.84 46.61,61.86 46.61,59.41 48.99,57.03 49.68,57.03 v5(50.12,56.59)
  vias: v1(47.87,62.85)
L_GL1: length 27.4
  Top Layer w0.254: Q2.5 57.4,82.04 51.69,82.04 50.55,80.9 50.55,62.17 U1.19
L_GL2: length 21.3
  Top Layer w0.254: U1.22 49.02,65.91 48.64,66.29 48.64,81.54 47.37,82.81
L_INEN: length 20.2
  Top Layer w0.254: JP1.1 53.34,40.51 47.88,35.05 47.88,30.61 49.53,28.96 52.02,28.96 U2.18
L_INPH: length 21.5
  Top Layer w0.254: JP1.3 59.56,38.61 53.34,38.61 49.02,34.29 49.02,31.5 50.36,30.15 U2.16
L_NFAULT: length 34
  Top Layer w0.254: U1.9 49.02,53.59 50.93,51.69 50.93,49.02 38.23,36.32 38.23,32.13 37.22,31.12 R7.1
L_PH: length 37.7
  Top Layer w0.254: 51.23,59.94 54.85,59.94 56.6,58.19 56.6,45.28 v5(55.8,44.47) ; v5(56.03,35.61) 55.38,34.97 55.38,30.56 56.94,29.01 57.31,29.01
  Bottom Layer w0.254: v5(55.8,44.47) 54.95,43.63 54.95,36.68 v5(56.03,35.61)
L_SH1: length 19.3
  Top Layer w0.254: 51.35,61.46 51.48,61.59 52.97,61.59 52.97,61.73 56.12,64.88 56.12,74.29 58.19,76.36 58.19,77.08
L_SH2: length 15.5
  Top Layer w0.254: 47.37,77.21 47.37,65.91 ; 47.37,65.91 48.52,64.76 U1.23
L_SN: length 13.1
  Top Layer w0.254: 50.07,64.39 50.14,64.32 ; 50.07,64.39 50.07,62.19 U1.20 ; 50.07,64.39 50.07,64.83 ; v5(46.93,64.12) 45.61,64.12 45.21,64.52 R3.1 ; 50.07,64.83 50.02,64.88 50.02,67.54 ; 50.07,64.83 50.05,64.81
  Bottom Layer w0.254: v5(46.93,64.12) 46.93,65.13 49.34,67.54 50.02,67.54
  vias: v5(49.9,67.53)
L_SNSOUT: length 39.4
  Top Layer w0.254: R4.1 37.34,25.65 38.86,27.18 38.86,36.32 51.56,49.02 51.56,51.69 49.52,53.73 U1.10
L_SP: length 42.7
  Top Layer w0.254: v6(49.44,66.71) 49.53,66.62 49.53,62.15 49.52,62.15 ; v1(46.71,81.79) 45.46,80.54 45.46,66.92 43.06,64.52 ; R3.2 44.36,63.34 v5(46.91,63.34) ; 56.48,80.21 56.48,80.22 v6(52.7,80.22)
  Bottom Layer w0.254: v5(46.91,63.34) 47.31,63.34 47.58,63.6 47.58,64.85 v6(49.44,66.71) ; v1(46.71,81.79) 48.23,80.26 52.73,80.26 52.72,80.25
R_AVDD: length 21.2
  Top Layer w0.254: 72.57,44.08 72.57,45.63 73.41,46.47 73.41,51.21 72.97,51.65 ; 73.37,52.03 73.37,52.33 U3.6 78.38,55.95 U3.7 ; 76.2,40.27 75.49,40.27 72.48,43.28 72.48,44.06
R_DVDD: length 27.9
  Top Layer w0.254: 79.69,36.58 79.69,37.87 83.09,41.27 ; 83.09,41.27 83.31,41.27 84.07,42.04 84.07,43.56 83.55,44.08 R5.2 ; 83.09,41.27 81.77,41.27 R6.2 78.88,45.14 U3.8
R_EN: length 50.1
  Top Layer w0.254: 58.17,29.47 58.65,29.47 59.2,30.02 v5(59.2,32.2) ; U3.14 82.1,57.14 82.68,56.57 82.68,54.61 84.27,53.02 v3(84.27,52.1)
  Bottom Layer w0.254: v5(59.2,32.2) 71.57,32.2 78.11,38.73 78.11,40.89 76.83,42.16 v3(75.69,42.16) 84.27,50.74 v3(84.27,52.1)
R_GH1: length 24
  Top Layer w0.254: 79.7,77.23 80.58,76.34 v3(80.58,76.12) ; 81.83,58.71 81.9,58.64 82,58.64 82.26,58.9 82.26,59.58 82.7,60.02 v3(82.89,60.02)
  Bottom Layer w0.254: 80.63,76.16 82.58,74.21 84.6,74.21 85.49,73.32 85.49,62.62 v3(82.89,60.02) ; v3(80.58,76.12) 80.61,76.12
R_GH2: length 21.7
  Top Layer w0.254: v3(76.11,63.41) 76.11,62.11 U3.24 ; Q3.3 68.2,75.44
  Bottom Layer w0.254: v3(68.2,75.44) 76.11,67.52 v3(76.11,63.41)
R_GL1: length 28.4
  Top Layer w0.254: 80.97,83.08 81.86,83.08 82.48,82.46 v6(82.48,81.82) ; U3.19 80.9,59.86 80.9,61.24 v3(81.81,62.15)
  Bottom Layer w0.254: v3(81.81,62.15) 81.81,68.32 80.46,69.67 80.46,73.65 78.93,75.18 78.93,79.86 80.81,81.73 82.4,81.73 v6(82.48,81.82)
R_GL2: length 36.3
  Top Layer w0.254: U3.22 79.38,60.83 78.42,61.79 v3(78.42,63.5) ; Q3.5 68.7,82.17 65.28,82.17 64.77,81.66 64.77,78.74 65.47,78.04 65.66,78.23 70.23,78.23 70.99,77.47 70.99,75.56 v3(70.87,75.44)
  Bottom Layer w0.254: v3(78.42,63.5) 78.42,67.88 v3(70.87,75.44)
R_INEN: length 20.9
  Top Layer w0.254: JP1.2 57.66,39.24 52.96,39.24 48.51,34.8 48.51,30.86 49.91,29.46 52.08,29.46 U2.17
R_INPH: length 22.2
  Top Layer w0.254: U2.15 50.73,30.8 49.66,31.88 49.66,34.16 53.34,37.85 61.34,37.85 JP1.4
R_NFAULT: length 11.5
  Top Layer w0.254: R6.1 79.38,45.17 U3.9
R_PH: length 64.4
  Top Layer w0.254: U2.5 57.09,30.15 56.26,30.99 56.26,33.27 57.15,34.16 58.55,34.16 63.12,38.73 65.15,38.73 65.28,38.86 65.28,41.4 64.39,42.29 64.39,57.28 72.01,64.9 80.39,64.9 84.2,61.09 84.2,58.55 83.3,57.64 U3.15
R_SH1: length 21.1
  Top Layer w0.254: v3(84.45,66.8) 84.45,73.87 80.79,77.53 ; U3.18 81.79,59.36 81.79,60.32 82.42,60.96 82.48,60.96 82.6,61.08
  Bottom Layer w0.254: v3(82.44,61.14) 82.44,61.15 84.12,62.83 84.12,66.47 v3(84.45,66.8)
R_SH2: length 21.4
  Top Layer w0.254: v3(77.22,62.36) 78.88,60.69 U3.23 ; Q3.4 69.47,75.44
  Bottom Layer w0.254: v3(69.47,75.44) 77.22,67.69 v3(77.22,62.36)
R_SN: length 12.2
  Top Layer w0.254: v3(81.03,66.8) 81.03,68.72 R10.1 ; U3.20 80.39,59.85 80.39,62.98 v3(80.68,63.27)
  Bottom Layer w0.254: v3(80.68,63.27) 80.68,66.46 v3(81.03,66.8)
R_SNSOUT: length 15
  Top Layer w0.254: U3.10 79.88,46.35 81.79,44.45 81.79,43.05 82.26,42.58 82.9,42.58
R_SP: length 35
  Top Layer w0.254: U3.21 79.88,61.47 79.5,61.85 79.5,62.17 v3(79.54,62.21) ; 79.02,80 78.84,80.18 67.72,80.18 ; v3(79.76,66.8) 79.76,68.95 R10.2 78.99,76.57 Q4.9
  Bottom Layer w0.254: v3(79.76,66.8) 79.54,66.58 v3(79.54,62.21)
$1N94: length 4.9
  Top Layer w0.254: U1.4 45.34,59.95 45.08,59.69 45.08,58.8 44.26,57.97 C3.1
$1N95: length 4
  Top Layer w0.254: C3.2 44.89,60.45 U1.3
$1N105: length 10.2
  Top Layer w0.254: U1.2 47.29,60.99 v7(44.94,60.99) ; v5(41.91,60.83) 41.84,60.9 38.61,60.9
  Bottom Layer w0.254: v5(41.91,60.83) 41.91,61.34 42.8,62.23 43.69,62.23 v7(44.94,60.99)
$1N139: length 34.7
  Top Layer w0.254: 51.02,55.35 51.02,55.38 50.93,55.47 50.93,56.76 50.52,57.16 U1.12 ; R8.1 45.36,37.59 v5(45.36,39.18)
  Bottom Layer w0.254: v5(50.99,55.47) 56.76,55.47 59.2,53.03 59.2,50.98 47.4,39.18 v5(45.36,39.18)
$1N238: length 27.9
  Top Layer w0.254: 45,83.69 45,83.69 v1(45.59,83.69) ; 45,83.69 45.59,83.69 v1(45.59,83.69) ; 45,83.69 44.75,83.44 44.75,82.75 ; 45,83.69 43.84,83.69 43.5,83.35 43.5,82.88 ; v1(45.59,83.69) 46.1,83.18 Q1.6
  Bottom Layer w0.254: 46.1,82.93 46.1,83.44 45.85,83.69 v1(45.59,83.69) 42.55,83.69 39.75,80.9 35.31,80.9 30.86,85.34 30.86,88.69
$1N2225: length 38.3
  Top Layer w0.254: 34.28,58.44 36.4,58.44 37.09,57.76 38.11,57.76 38.75,58.4 38.75,59.68 ; v6(37.07,60.28) 37.59,59.76 ; 37.59,59.76 42.73,59.76 44.49,61.52 47.23,61.52 ; C7.1 31.95,66.84 D1.1
  Bottom Layer w0.254: 37.31,60.26 37.16,60.26 ; 37.31,60.26 C7.1 ; 37.31,60.26 37.37,60.21
$1N6642: length 18.6
  Top Layer w0.254: v3(74.18,45.84) 74.18,44.43 74.15,44.41 ; v3(81.55,50.78) 81.72,50.95 81.72,51.97 81.3,52.4 81.3,55.27 80.97,55.6 80.97,55.8
  Bottom Layer w0.254: v3(81.55,50.78) 77.99,50.78 77.98,50.8 74.17,46.99 74.17,44.2
$1N6643: length 5.3
  Top Layer w0.254: C14.2 76.22,58.72 77.62,58.72 U3.2
$1N6644: length 5.5
  Top Layer w0.254: U3.4 72.51,57.64 C11.1
$1N6647: length 30.8
  Top Layer w0.254: C15.1 68.81,71.97 C12.1 76.2,70.17 D2.1 ; v3(71.76,62.74) 71.82,62.8 C14.1 74.03,62.8 U3.1
  Bottom Layer w0.254: v3(71.76,62.74) 71.76,68.58 v3(71.88,68.71)
$1N6664: length 5.7
  Top Layer w0.254: C11.2 72.85,58.22 77.62,58.22 U3.3
$1N6665: length 13.2
  Top Layer w0.254: 79.58,87.87 75.4,83.68 68.1,83.68
$1N13007: length 14.7
  Top Layer w0.254: 62.4,22.64 73.55,22.64 76.08,25.17

## Copper pours and planes (outline as drawn; the poured copper is in the pictures)
GND on Top Layer: 22.27,96.66 89.97,96.66 89.97,16.16 22.27,16.16
GND on Top Layer: 78.96,94.75 78.01,93.8 78.01,92.47 78.84,91.63 80.74,91.63 81.78,90.6 81.78,87.27 79.23,84.72 77.24,84.72 76.64,84.12 76.64,82.4 76.73,82.31 79.97,82.31 80,82.28 80,84.15 82.49,86.65 82.67,86.65 83.24,87.21 83.24,90.59 81.42,92.41 81.42,93.75 80.42,94.75
GND on Top Layer: 76.73,84.07 80.12,84.07 80.12,82.63 76.73,82.63
GND on Top Layer: 54.18,84.07 57.32,84.07 57.32,82.43 54.18,82.43
GND on Top Layer: 40.09,92.75 44.41,92.75 44.46,92.79 46.06,92.79 50.47,88.38 51.67,88.4 52.63,88.38 52.59,88.36 52.83,88.36 53.7,87.49 53.7,83.83 53.94,83.59 53.94,82.62 54.14,82.42 54.95,82.42 55.03,82.34 57.31,82.34 57.45,82.48 57.45,87.23 58.76,88.55 64.05,88.55 67.81,92.3 78.39,92.3 78.48,92.4 76.76,94.12 76.76,94.43 67.44,94.43 67.17,94.7 62.41,89.95 62.41,89.81 58.52,89.81 58.29,90.04 57.98,90.04 56.44,88.5 56.44,85.02 54.76,85.02 54.72,85.06 54.72,88.5 54.76,88.55 53.86,89.45 50.33,89.45 46.07,93.71 45.3,93.71 44.67,94.34 44.67,94.48 44.4,94.75 42.04,94.75 40.09,92.8
GND on Bottom Layer: 21.62,97.15 89.97,97.15 89.97,16.33 21.62,16.33
VBAT on Top Layer: 64.8,77.85 66.73,77.85 66.73,76.17 64.8,76.17
VBAT on Top Layer: 64.28,77.35 66.97,77.35 66.97,75.35 64.28,75.35
VBAT on Bottom Layer: 65.15,77.44 67.18,77.44 67.18,76.09 65.15,76.09
VBAT on Bottom Layer: 53.93,77.3 56.26,77.3 56.26,76 53.93,76
VBAT on Bottom Layer: 76.78,77.31 78.33,77.31 78.33,76.38 76.78,76.38
(no net) on Top Layer: 67.36,77.58 65.07,77.58 65.07,76.26
$1N6665 on Top Layer: 65.23,84.14 68.47,84.14 68.47,82.39 65.23,82.39

Small or netless copper shapes (teardrops, artwork), in the pictures only: 3 on Top Layer

## Text on the board
Top Layer: 学习2023年1月

# Board PCB1_1
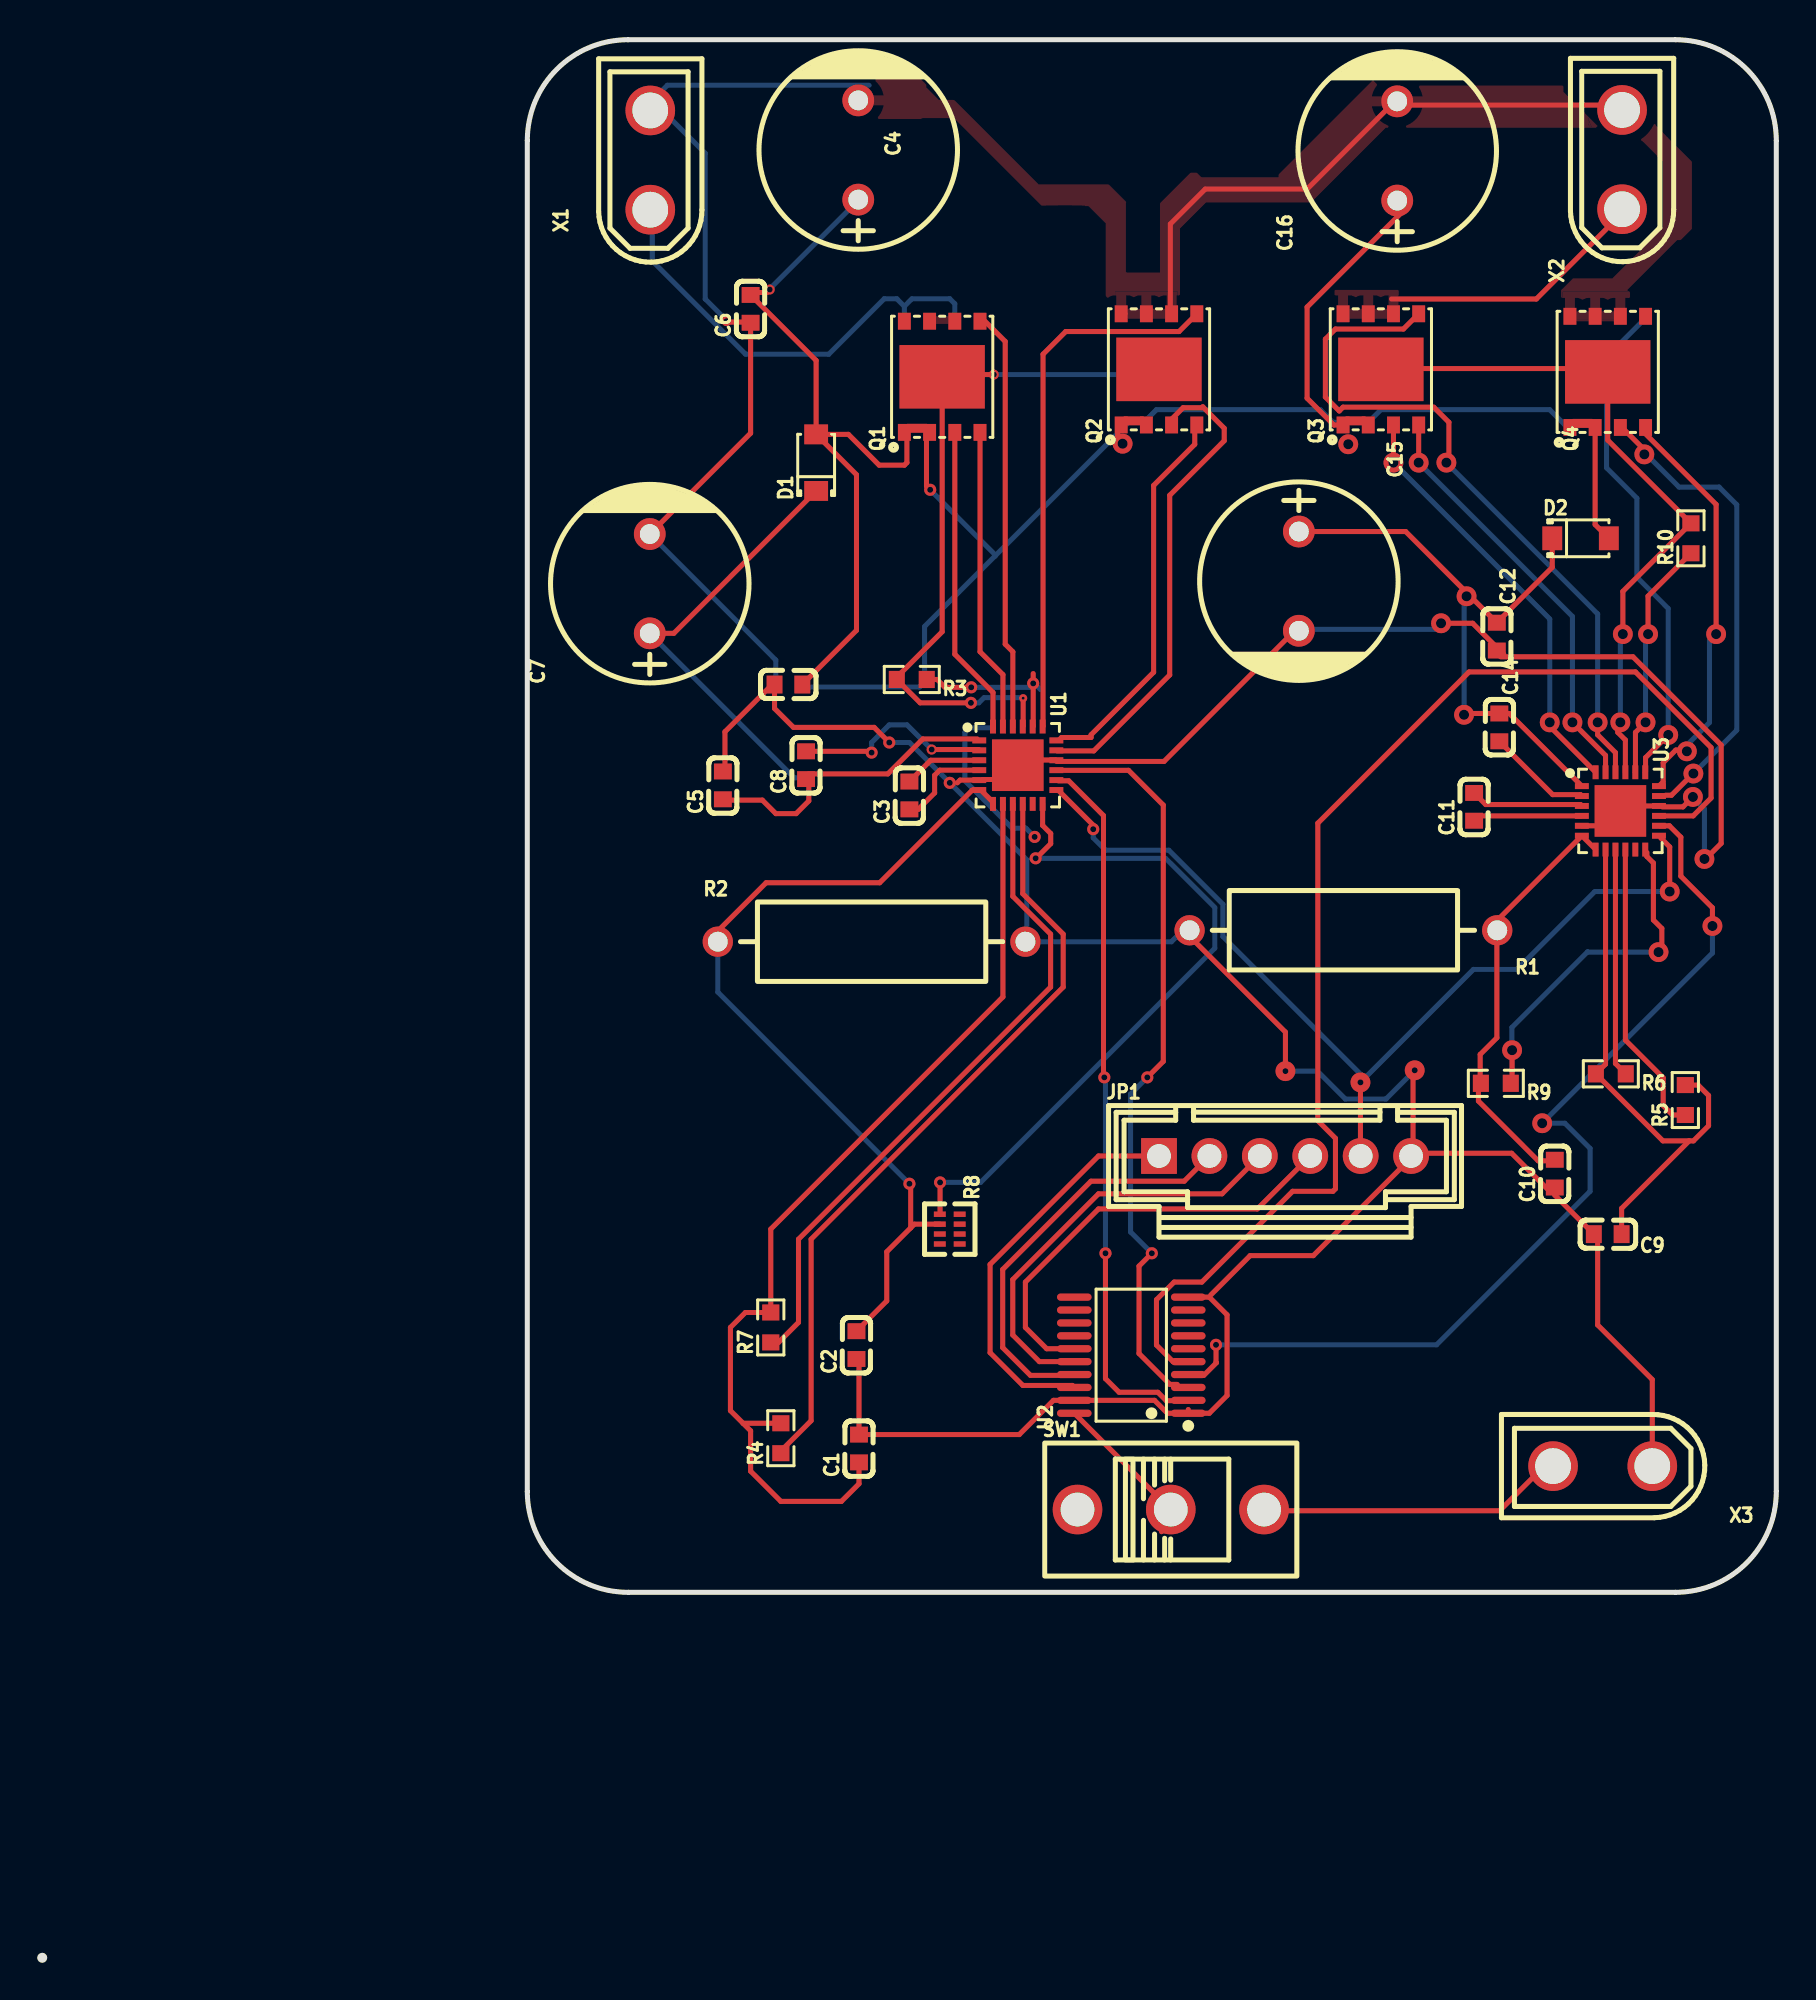
[diagram p4: board, top side]
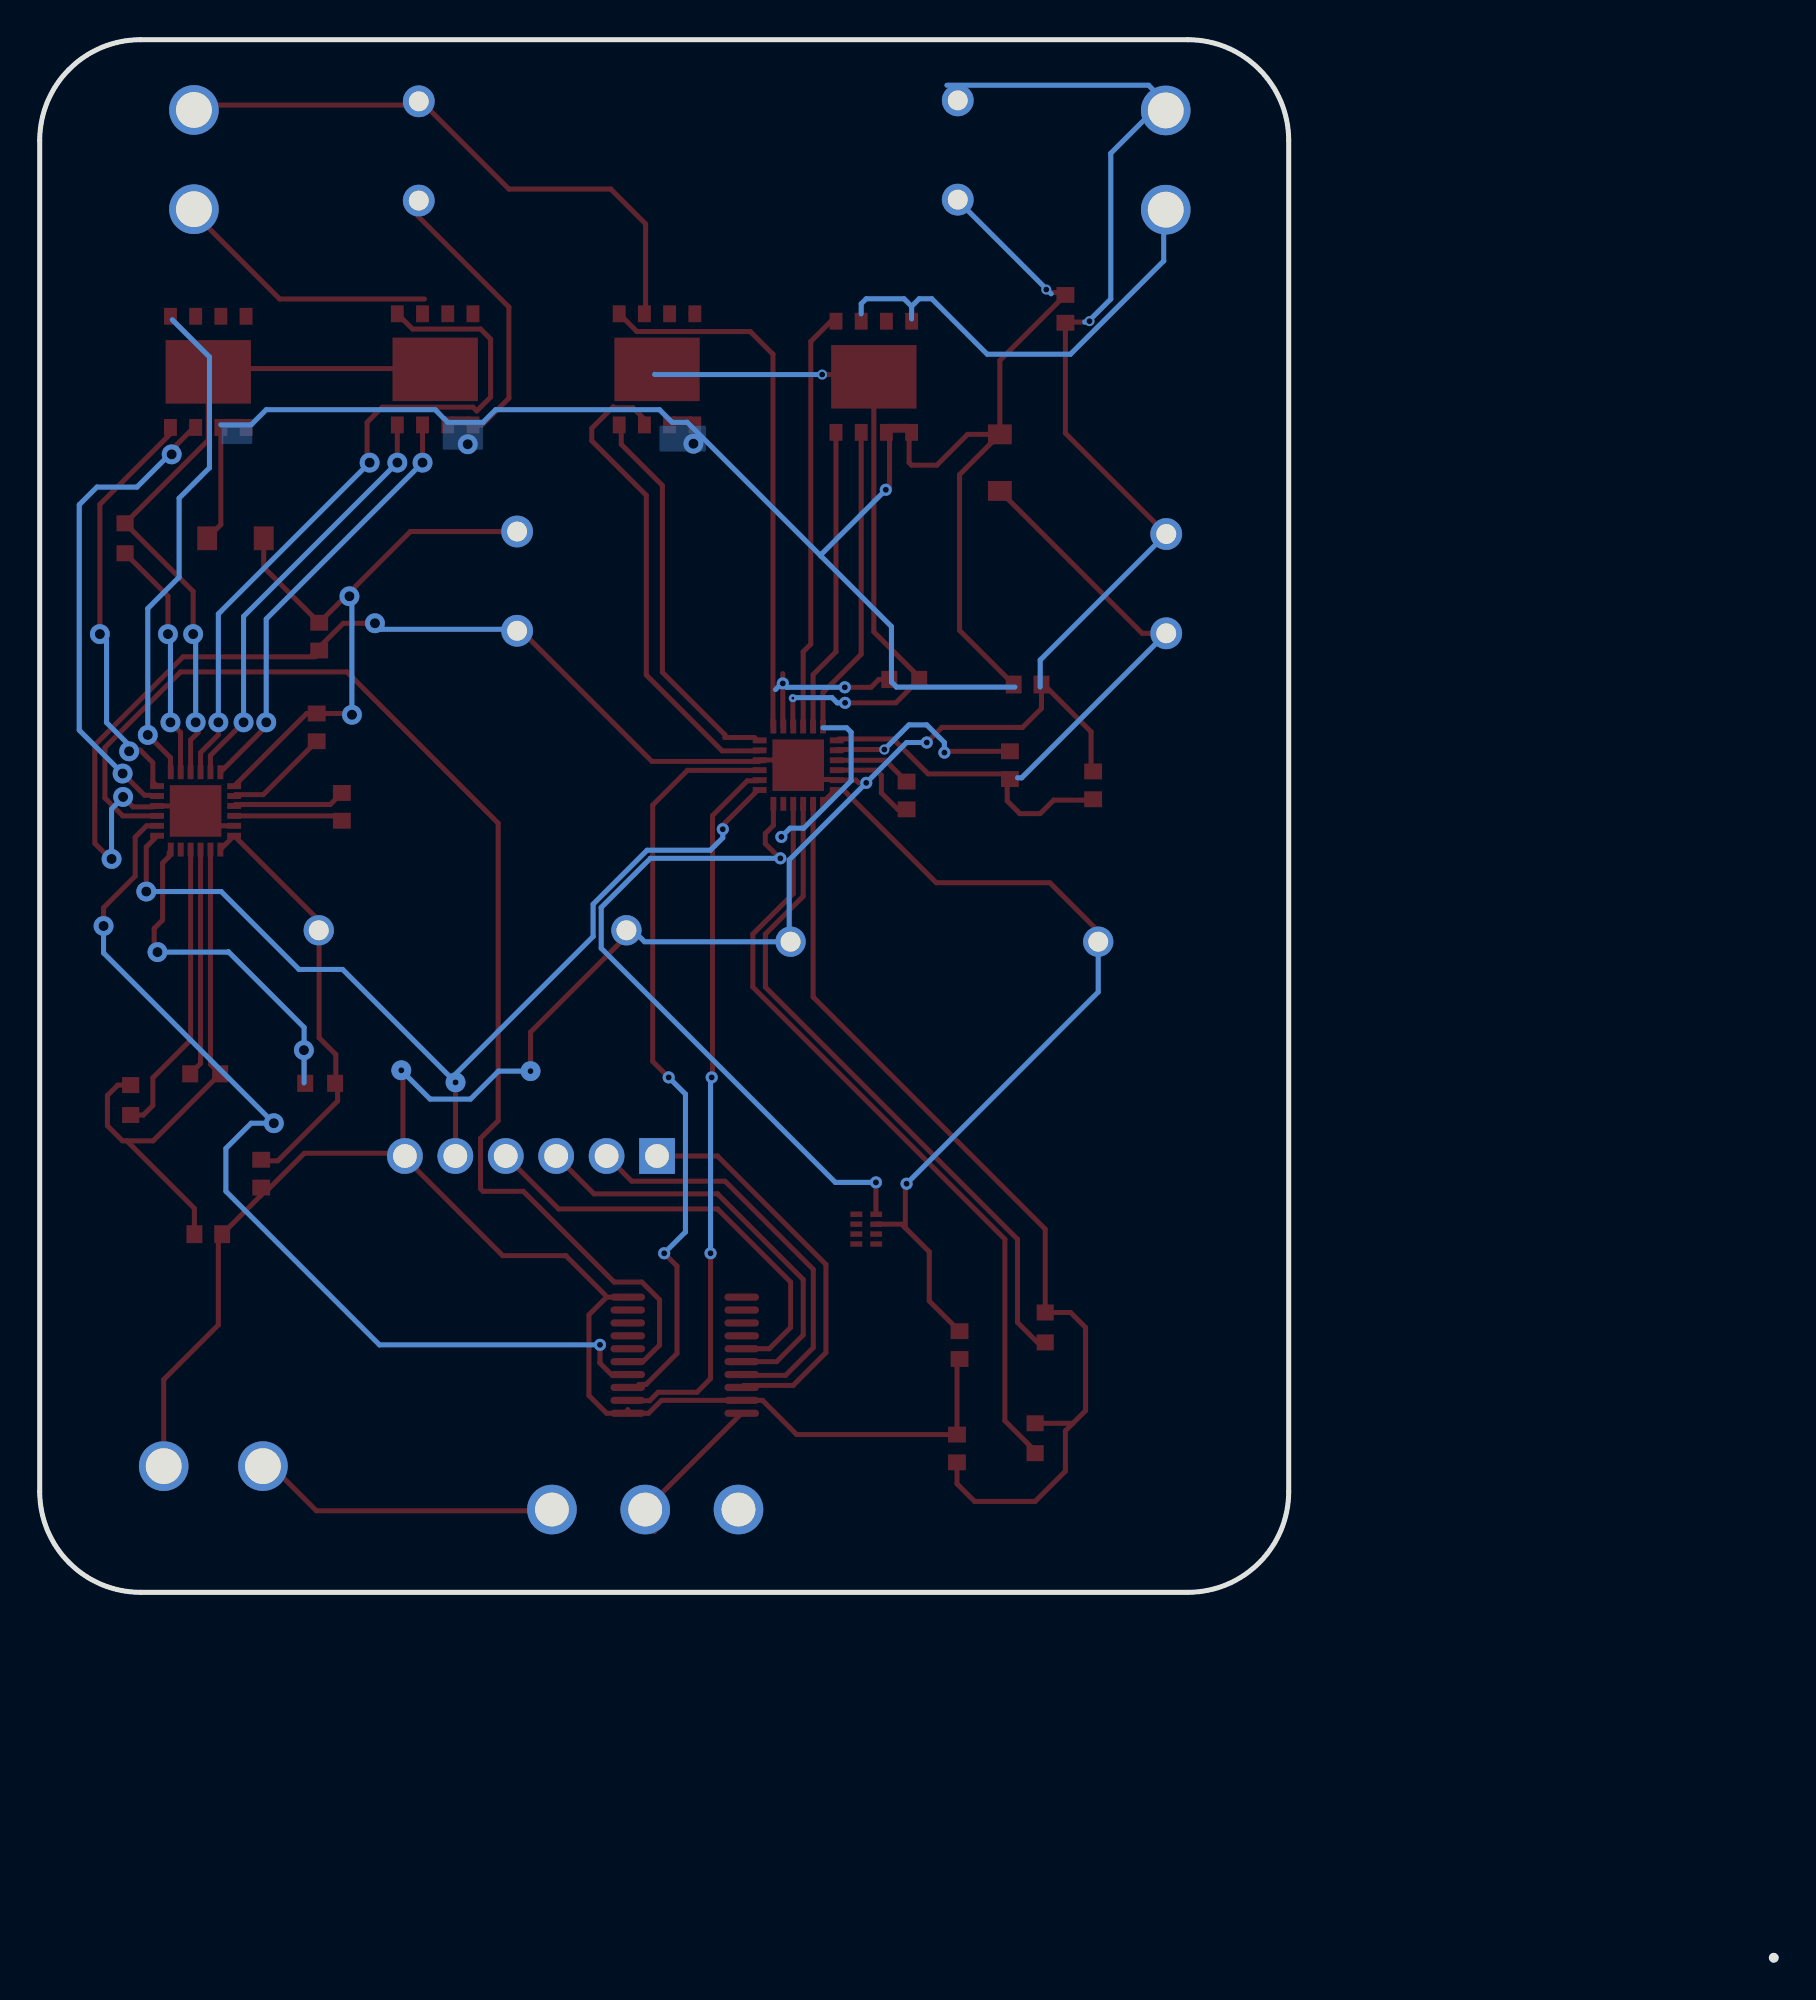
[diagram p5: board, bottom side, seen from below]

Outline 87.49 x 96.74 mm; copper layers: Top Layer, Bottom Layer. Coordinates in mm from the lower left corner of the outline.
Outline path: circle c0.13,0.13 r0.13 ; 24.56,91.66 arc(26.05,95.25) 29.64,96.74 82.41,96.74 arc(86,95.25) 87.49,91.66 87.49,23.62 arc(86,20.02) 82.41,18.54 29.64,18.54 arc(26.05,20.02) 24.56,23.62 24.56,91.66
Stack: Top Layer 0.035mm / Dielectric1 1.51mm FR4 er 4.5 / Bottom Layer 0.035mm

## Design rules (mm)
spacing safeClearance (default): track to track 0.152, other pairs 0.152 to 0.3
track width trackWidth (default): min 0.127, default 0.254, max 2.54
differential pair differentialPair (default): width min 0.127, default 0.254, max 2.54; gap min 0.152, default 0.152
via viaSize (default): diameter min 0.5, default 0.61, max 10; hole min 0.3, default 0.305, max 6

## Placement (name value [footprint] x y rotation side)
C1  1uF  [C0603]  41.27 25.78 90 top
C2  1uF  [C0603]  41.15 30.99 90 top
C3  100nF  [C0603]  43.81 58.67 90 top
C4  10uF  [CAP-TH_BD10.0-P5.00-D0.6-FD]  41.24 91.19 90 top
C5  10nF  [C0603]  34.42 59.18 90 top
C6  100nF  [C0603]  35.81 83.18 90 top
C7  10uF  [CAP-TH_BD10.0-P5.00-D0.6-FD]  30.73 69.34 90 top
C8  1uF  [C0603]  38.61 60.2 90 top
C9  1uF  [C0603]  78.99 36.58 180 top
C10  1uF  [C0603]  76.33 39.62 90 top
C11  100nF  [C0603]  72.26 58.1 90 top
C12  10nF  [C0603]  73.41 66.67 270 top
C13  100nF  [C0603]  37.72 64.26 0 top
C14  1uF  [C0603]  73.53 62.1 270 top
C15  10uF  [CAP-TH_BD10.0-P5.00-D0.6-FD]  63.43 69.47 270 top
C16  10uF  [CAP-TH_BD10.0-P5.00-D0.6-FD]  68.39 91.14 90 top
D1  MBR120ESFT1G  [SOD-123F_L2.7-W1.7-LS3.6-RD]  39.12 75.44 90 top
D2  MBR120ESFT1G  [SOD-123F_L2.7-W1.7-LS3.6-RD]  77.62 71.63 0 top
JP1  杜邦2.54-6AS  [CONN-TH_6P-P2.54_C50130]  62.74 40.51 0 top
Q1  CSD87350Q5D  [LSON-8_L6.0-W5.0-P1.27-LS6.0-TL-EP]  45.47 79.76 90 top
Q2  CSD87350Q5D  [LSON-8_L6.0-W5.0-P1.27-LS6.0-TL-EP]  56.39 80.14 90 top
Q3  CSD87350Q5D  [LSON-8_L6.0-W5.0-P1.27-LS6.0-TL-EP]  67.57 80.14 90 top
Q4  CSD87350Q5D  [LSON-8_L6.0-W5.0-P1.27-LS6.0-TL-EP]  79 80.01 90 top
R1  3.3kΩ  [RES-TH_BD4.0-L11.5-P15.50-D0.7]  65.68 51.88 180 top
R2  3.3kΩ  [RES-TH_BD4.0-L11.5-P15.50-D0.7]  41.91 51.31 0 top
R3  50m  [R0603]  43.93 64.52 180 top
R4  CMFA103J3600HANT  [R0603]  37.34 26.3 90 top
R5  CMFA103J3600HANT  [R0603]  82.9 43.33 90 top
R6  CMFA103J3600HANT  [R0603]  79.15 44.65 180 top
R7  CMFA103J3600HANT  [R0603]  36.83 31.88 90 top
R8  33kΩ  [RES-ARRAY-SMD_0804-8P-L2.0-W1.0-BL]  45.85 36.83 270 top
R9  33k  [R0603]  73.36 44.17 180 top
R10  50m  [R0603]  83.18 71.63 90 top
SW1  SS-12D10L3  [SW-TH_SS-12D10L3]  56.98 22.7 0 top
U1  DRV8701ERGET  [VQFN-24_L4.0-W4.0-P0.50-BL-EP2.5]  49.27 60.2 270 top
U2  SN74HC245PW  [TSSOP-20_L6.5-W4.4-P0.65-LS6.4-BL]  54.99 30.48 90 top
U3  DRV8701ERGET  [VQFN-24_L4.0-W4.0-P0.50-BL-EP2.5]  79.63 57.89 270 top
X1  XT30UPB-M  [CONN-TH_XT30UPB-M]  30.76 90.68 90 top
X2  XT30UPB-M  [CONN-TH_XT30UPB-M]  79.72 90.7 90 top
X3  XT30UPB-M  [CONN-TH_XT30UPB-M]  78.74 24.89 180 top

## Footprints (pads in the part's own frame, mm; a bottom-side part is the same pattern mirrored in y, then rotated)
C0603
  rect 0.8x0.9 smd: 1(-0.7,0) 2(0.7,0)
CAP-TH_BD10.0-P5.00-D0.6-FD
  round 1.6 hole 1: 1(-2.5,0) 2(2.5,0)
CONN-TH_6P-P2.54_C50130
  rect 1.801x1.801 hole 1.199: 1(-6.35,0)
  round 1.801 hole 1.199: 2(-3.81,0) 3(-1.27,0) 4(1.27,0) 5(3.81,0) 6(6.35,0)
CONN-TH_XT30UPB-M
  round 2.499 hole 1.801: 1(-2.499,0) 2(2.499,0)
LSON-8_L6.0-W5.0-P1.27-LS6.0-TL-EP
  rect 0.85x0.65 smd: 1(-2.8,1.905) 2(-2.8,0.635) 3(-2.8,-0.635) 4(-2.8,-1.905) 5(2.8,-1.905) 6(2.8,-0.635) 7(2.8,0.635) 8(2.8,1.905)
  rect 0.45x1 smd: 1(-2.594,1.27)
  rect 3.2x4.3 smd: 9(0,0.002)
R0603
  rect 0.806x0.864 smd: 1(-0.753,0) 2(0.753,0)
RES-ARRAY-SMD_0804-8P-L2.0-W1.0-BL
  rect 0.275x0.6 smd: 1(-0.75,-0.5) 2(-0.249,-0.5) 3(0.249,-0.5) 4(0.75,-0.5) 5(0.75,0.5) 6(0.249,0.5) 7(-0.249,0.5) 8(-0.75,0.5)
RES-TH_BD4.0-L11.5-P15.50-D0.7
  round 1.524 hole 1.001: 1(-7.75,0) 2(7.75,0)
SOD-123F_L2.7-W1.7-LS3.6-RD
  rect 1.001x1.199 smd: 1(-1.425,0) 2(1.425,0)
SW-TH_SS-12D10L3
  round 2.499 hole 1.7: 1(-4.699,0) 2(0,0) 3(4.699,0)
TSSOP-20_L6.5-W4.4-P0.65-LS6.4-BL
  oval 0.364x1.742 smd: 1(-2.925,-2.871) 2(-2.275,-2.871) 3(-1.625,-2.871) 4(-0.975,-2.871) 5(-0.325,-2.871) 6(0.325,-2.871) 7(0.975,-2.871) 8(1.625,-2.871) 9(2.275,-2.871) 10(2.925,-2.871) 11(2.925,2.871) 12(2.275,2.871) 13(1.625,2.871) 14(0.975,2.871) 15(0.325,2.871) 16(-0.325,2.871) 17(-0.975,2.871) 18(-1.625,2.871) 19(-2.275,2.871) 20(-2.925,2.871)
VQFN-24_L4.0-W4.0-P0.50-BL-EP2.5
  rect 0.3x0.7 smd: 1(-1.25,-1.942) 2(-0.75,-1.942) 3(-0.25,-1.942) 4(0.25,-1.942) 5(0.75,-1.942) 6(1.25,-1.942) 13(1.25,1.942) 14(0.75,1.942) 15(0.25,1.942) 16(-0.25,1.942) 17(-0.75,1.942) 18(-1.25,1.942)
  rect 0.7x0.3 smd: 7(1.948,-1.25) 8(1.948,-0.75) 9(1.948,-0.25) 10(1.948,0.25) 11(1.948,0.75) 12(1.948,1.25) 19(-1.948,1.25) 20(-1.948,0.75) 21(-1.948,0.25) 22(-1.948,-0.25) 23(-1.948,-0.75) 24(-1.948,-1.25)
  rect 2.6x2.6 smd: 25(0.001,-0.001)

## Nets
+5V: JP1.5 U1.13 U3.13
GND: C1.2 C2.1 C4.2 C5.2 C6.1 C7.2 C9.2 C10.1 C12.2 C13.1 C15.2 C16.2 JP1.6 Q2.6 Q2.7 Q2.8 Q4.6 Q4.7 Q4.8 R1.2 R2.2 U1.5 U1.16 U1.25 U2.1 U2.10 U2.19 U3.5 U3.16 U3.25 X1.2 X2.2 X3.1
VBAT: C4.1 C6.2 C13.2 C16.1 D1.2 D2.2 Q1.1 Q1.2 Q2.1 Q2.2 Q3.1 Q3.2 Q4.1 Q4.2
VCC: SW1.2 U2.20
L_AVDD: C2.2 R2.1 R8.2 U1.6 U1.7
L_DVDD: C1.1 R4.2 R7.2 U1.8
L_EN: U1.14 U2.2
L_GH1: Q2.3 U1.17
L_GH2: Q1.3 U1.24
L_GL1: Q2.5 U1.19
L_GL2: Q1.5 U1.22
L_INEN: JP1.1 U2.18
L_INPH: JP1.3 U2.16
L_NFAULT: R7.1 U1.9
L_PH: U1.15 U2.3
L_SH1: Q2.4 U1.18
L_SH2: Q1.4 U1.23
L_SN: R3.1 U1.20
L_SNSOUT: R4.1 U1.10
L_SO: U1.11
L_SP: Q1.9 Q2.9 R3.2 U1.21
R_AVDD: C10.2 R1.1 R9.2 U3.6 U3.7
R_DVDD: C9.1 R5.2 R6.2 U3.8
R_EN: U2.4 U3.14
R_GH1: Q4.3 U3.17
R_GH2: Q3.3 U3.24
R_GL1: Q4.5 U3.19
R_GL2: Q3.5 U3.22
R_INEN: JP1.2 U2.17
R_INPH: JP1.4 U2.15
R_NFAULT: R6.1 U3.9
R_PH: U2.5 U3.15
R_SH1: Q4.4 U3.18
R_SH2: Q3.4 U3.23
R_SN: R10.1 U3.20
R_SNSOUT: R5.1 U3.10
R_SO: U3.11
R_SP: Q3.9 Q4.9 R10.2 U3.21
$1N94: C3.1 U1.4
$1N95: C3.2 U1.3
$1N105: C8.2 U1.2
$1N139: R8.1 U1.12
$1N238: Q1.6 Q1.7 Q1.8 X1.1
$1N2225: C5.1 C7.1 C8.1 D1.1 U1.1
$1N6642: R9.1 U3.12
$1N6643: C14.2 U3.2
$1N6644: C11.1 U3.4
$1N6647: C12.1 C14.1 C15.1 D2.1 U3.1
$1N6664: C11.2 U3.3
$1N6665: Q3.6 Q3.7 Q3.8 X2.1
$1N13007: SW1.3 X3.2

Pads without a net: R8 3 4 5 6 7 8; SW1 1; U2 6 7 8 9 11 12 13 14

## Via types
v1: diameter 0.5, hole 0.3, Top Layer to Bottom Layer, 3 vias
v2: diameter 1.001, hole 0.508, Top Layer to Bottom Layer, 27 vias
v3: diameter 1.001, hole 0.3, Top Layer to Bottom Layer, 1 via
v4: diameter 0.61, hole 0.305, Top Layer to Bottom Layer, 17 vias
v5: diameter 1.001, hole 0.305, Top Layer to Bottom Layer, 2 vias
v6: diameter 0.406, hole 0.152, Top Layer to Bottom Layer, 1 via
v7: diameter 0.508, hole 0.305, Top Layer to Bottom Layer, 1 via

## Routing (per net, layer and track width the routed paths; a pad name or vN(x,y) marks a point on that pad's centre or on a via; arc(x,y) is an arc through that point)
+5V: length 48.6
  Top Layer w0.254: v5(66.54,44.22) 66.54,40.64 66.46,40.56 ; v2(82.12,53.83) 82.12,56.08 81.67,56.53 ; v4(53.07,56.97) 53.07,57.18 51.39,58.86
  Bottom Layer w0.254: v2(82.12,53.83) 78.34,53.83 74.42,49.91 72.23,49.91 v5(66.54,44.22) ; 66.62,44.55 59.61,51.57 59.61,53.19 56.89,55.91 53.7,55.91 53.07,56.54 v4(53.07,56.97)
GND: length 260
  Top Layer w0.254: 46.23,59.31 46.37,59.45 U1.5 ; U2.1 57.86,27.74 ; U2.1 58.92,27.55 59.82,28.45 59.82,32.51 58.92,33.4 U2.10 ; U2.1 56.81,27.55 56.16,28.2 U2.19 51.07,28.2 49.35,26.48 C1.2 41.27,30.16 C2.1 ; U3.5 78.88,57.14 U3.25 79.88,58.14 U3.16 ; 58.04,51.47 62.76,46.75 v3(62.76,44.79) ; 73.76,65.78 72.19,67.35 v2(70.6,67.35) ; 69.27,40.65 74.15,40.65 75.96,38.85 ; Q2.8 54.67,82.94 54.5,82.77 ; 51.23,60.39 56.64,60.39 63.52,67.27 ; X3.1 81.24,29.25 78.49,32 78.49,36.38 C9.2 76.33,38.54 C10.1 ; v5(69.27,44.83) 69.19,44.75 69.19,41.31 ; 79.65,93.54 79.74,93.45 ; 79.74,93.45 68.48,93.45 ; 79.74,93.45 79.94,93.45 79.97,93.48 ; 51.2,60.45 51.19,60.46 50.52,60.46 50.33,60.28 49.63,60.28 ; 68.1,93.47 63.85,89.22 58.72,89.22 56.96,87.46 56.96,83.01 ; 69.2,40.72 69.2,40.54 64.16,35.49 60.98,35.49 59,33.51 ; v2(83.29,58.6) 82.78,58.1 81.75,58.1 ; v2(83.87,55.48) 83.92,55.48 84.71,56.26 84.71,61.21 80.26,65.66 73.6,65.66 ; C6.1 35.81,76.92 C7.2 ; 47.51,59.48 48.59,59.48 49.34,60.22 ; 34.58,59.89 34.52,59.95 34.52,61.88 36.93,64.29 ; 35.82,82.52 34.65,82.52 v1(34.6,82.57) ; v4(42.8,61.34) 42.04,62.1 37.97,62.1 37.02,63.06 C13.1
  Bottom Layer w0.254: C7.2 37.08,65.49 37.08,64.13 ; v4(42.8,61.34) 43.81,61.34 v4(45.85,59.31) 49.73,55.43 49.73,51.42 ; 41.78,94.45 31.62,94.45 30.86,93.69 33.53,91.02 33.53,83.68 34.69,82.52 34.84,82.52 ; v2(70.6,67.35) 70.29,67.04 63.74,67.04 ; 83.06,58.8 83.87,57.99 v2(83.87,55.48) ; v5(69.27,44.83) 67.82,43.38 65.78,43.38 64.37,44.79 v3(62.76,44.79) ; 57.74,52.03 57.01,51.3 49.83,51.3
VBAT: length 114.3
  Top Layer w0.254: 54.31,77.18 54.31,76.64 v2(54.55,76.39) ; D1.2 40.74,76.86 42.29,75.31 43.56,75.31 43.69,75.44 43.69,77.08 43.56,77.21 ; D1.2 39.12,80.58 C6.2 ; D1.2 41.15,74.83 41.15,66.99 C13.2 ; 65.81,77.33 65.2,77.33 63.85,78.68 63.85,83.28 68.78,88.2 ; Q4.2 78.36,72.32 D2.2 ; 35.86,84.01 36.63,84.01 v1(36.78,84.16) ; 44.67,76.7 44.67,74.26 v4(44.86,74.07)
  Bottom Layer w0.254: 78.36,77.34 76.83,77.34 76.07,78.1 67.56,78.1 66.93,77.47 65.15,77.47 64.52,78.1 56.26,78.1 55.63,77.47 54.86,77.47 48.13,70.73 ; v4(44.86,74.07) 48.13,70.8 48.13,70.73 ; 48.13,70.73 44.58,67.18 44.58,64.39 44.32,64.13 38.35,64.13 ; 36.53,83.94 41.27,88.69
  vias: v2(65.92,76.37)
VCC: length 7.8
  Top Layer w0.254: 56.52,21.59 56.52,23.16 U2.20
(no net): length 8.4
  Bottom Layer w0.254: v1(48.07,79.87) 56.48,79.87 56.5,79.89
L_AVDD: length 43.3
  Top Layer w0.254: 43.88,36.89 44.06,37.08 R8.2 ; 43.88,36.89 43.88,39.05 v4(43.81,39.12) ; 43.88,36.89 42.67,35.69 42.67,33.21 C2.2 ; 47.48,58.88 48,58.36 48,58.34 ; 34.15,51.84 36.6,54.28 42.32,54.28 46.98,58.94 47.44,58.94
  Bottom Layer w0.254: R2.1 34.16,48.77 v4(43.81,39.12)
L_DVDD: length 49.9
  Top Layer w0.254: 35.43,27.05 34.8,27.69 34.8,31.88 35.55,32.63 R7.2 36.83,36.83 48.52,48.52 U1.8 ; 35.43,27.05 R4.2 ; 35.43,27.05 35.81,26.67 35.81,24.64 37.34,23.11 40.39,23.11 41.27,24 C1.1
L_EN: length 35.6
  Top Layer w0.254: 57.43,28.19 56.75,28.19 56.33,28.61 54.38,28.61 53.69,29.3 v4(53.69,35.61) ; 51.32,59.41 51.84,59.41 53.59,57.66 53.59,44.51 v4(53.63,44.47)
  Bottom Layer w0.254: v4(53.69,35.61) 53.69,44.41 v4(53.63,44.47)
L_GH1: length 24.5
  Top Layer w0.254: 56.93,77.35 56.93,77.53 57.6,78.21 58.55,78.21 58.59,78.25 59.67,77.17 59.67,76.54 56.93,73.79 56.93,64.74 53.1,60.92 51.26,60.92
L_GH2: length 24.5
  Top Layer w0.254: 46.1,65.79 48.02,63.86 U1.24 ; 46.1,77.21 46.1,65.79
  Bottom Layer w0.254: 48.03,62.08 46.84,62.08 46.61,61.86 46.61,59.41 48.99,57.03 49.68,57.03 v4(50.12,56.59)
L_GL1: length 27.4
  Top Layer w0.254: U1.19 50.55,62.17 50.55,80.9 51.69,82.04 57.4,82.04 Q2.5
L_GL2: length 21.3
  Top Layer w0.254: U1.22 49.02,65.91 48.64,66.29 48.64,81.54 47.37,82.81
L_INEN: length 20.2
  Top Layer w0.254: U2.18 52.02,28.96 49.53,28.96 47.88,30.61 47.88,35.05 53.34,40.51 JP1.1
L_INPH: length 21.5
  Top Layer w0.254: JP1.3 59.56,38.61 53.34,38.61 49.02,34.29 49.02,31.5 50.36,30.15 U2.16
L_NFAULT: length 34
  Top Layer w0.254: U1.9 49.02,53.59 50.93,51.69 50.93,49.02 38.23,36.32 38.23,32.13 37.22,31.12 R7.1
L_PH: length 37.7
  Top Layer w0.254: v4(55.8,44.47) 56.6,45.28 56.6,58.19 54.85,59.94 51.23,59.94 ; 57.31,29.01 56.94,29.01 55.38,30.56 55.38,34.97 v4(56.03,35.61)
  Bottom Layer w0.254: v4(55.8,44.47) 54.95,43.63 54.95,36.68 v4(56.03,35.61)
L_SH1: length 19.3
  Top Layer w0.254: 51.35,61.46 51.48,61.59 52.97,61.59 52.97,61.73 56.12,64.88 56.12,74.29 58.19,76.36 58.19,77.08
L_SH2: length 15.5
  Top Layer w0.254: 47.37,65.91 48.52,64.76 U1.23 ; 47.37,77.21 47.37,65.91
L_SN: length 8.9
  Top Layer w0.254: v4(46.93,64.12) 45.61,64.12 45.21,64.52 R3.1 ; v4(50.05,64.32) 50.05,62.17 U1.20 ; v4(50.05,64.32) 50.05,64.81 ; v4(50.05,64.32) 50.14,64.32
  Bottom Layer w0.254: 50.42,64.01 50.11,64.32 v4(50.05,64.32) 49.85,64.12 v4(46.93,64.12)
L_SNSOUT: length 39.4
  Top Layer w0.254: U1.10 49.52,53.73 51.56,51.69 51.56,49.02 38.86,36.32 38.86,27.18 37.34,25.65 R4.1
L_SP: length 27.5
  Top Layer w0.254: 43.06,64.52 45.46,66.92 45.46,79.87 ; 48.15,79.85 48.12,79.87 45.44,79.87 ; v6(49.54,63.57) 49.54,62.17 49.52,62.15 ; R3.2 44.36,63.34 v4(46.91,63.34)
  Bottom Layer w0.254: v6(49.54,63.57) 49.52,63.6 47.58,63.6 47.31,63.34 v4(46.91,63.34)
R_AVDD: length 21.2
  Top Layer w0.254: U3.7 78.38,55.95 U3.6 73.37,52.33 73.37,52.03 ; 72.97,51.65 73.41,51.21 73.41,46.47 72.57,45.63 72.57,44.08 ; 72.48,44.06 72.48,43.28 75.49,40.27 76.2,40.27
R_DVDD: length 27.9
  Top Layer w0.254: 83.09,41.27 81.77,41.27 R6.2 78.88,45.14 U3.8 ; 83.09,41.27 79.69,37.87 79.69,36.58 ; 83.09,41.27 83.31,41.27 84.07,42.04 84.07,43.56 83.55,44.08 R5.2
R_EN: length 49.4
  Top Layer w0.254: 58.17,29.47 58.65,29.47 59.28,30.1 59.26,30.12 v4(59.26,31) ; U3.14 82.1,57.14 82.68,56.57 82.68,54.61 84.27,53.02 v2(84.27,52.1)
  Bottom Layer w0.254: v2(84.27,52.1) 84.27,50.74 v2(75.69,42.16) 76.83,42.16 78.11,40.89 78.11,38.73 70.37,31 v4(59.26,31)
R_GH1: length 23.7
  Top Layer w0.254: 81.91,58.69 82.21,58.69 82.96,59.44 ; v2(80.84,75.86) 80.84,76.09 79.7,77.23
  Bottom Layer w0.254: v2(83.31,59.78) 85.49,61.96 85.49,73.32 84.6,74.21 82.58,74.21 80.63,76.16 80.59,76.16 ; v2(80.84,75.86) 80.84,75.87
R_GH2: length 21.7
  Top Layer w0.254: Q3.3 68.2,75.44 ; U3.24 76.07,62.15 v2(76.07,62.36)
  Bottom Layer w0.254: v2(76.07,62.36) 76.07,67.56 v2(68.2,75.44)
R_GL1: length 25.3
  Top Layer w0.254: v2(82.04,61.72) 80.9,60.58 80.9,59.86 U3.19
  Bottom Layer w0.254: v2(82.04,61.72) 82.04,68.09 80.46,69.67 80.46,73.65 78.93,75.18 78.93,80.76 80.81,82.64
R_GL2: length 36.3
  Top Layer w0.254: U3.22 79.38,60.83 78.49,61.73 v2(78.49,62.36) ; Q3.5 68.7,82.17 65.28,82.17 64.77,81.66 64.77,78.74 65.47,78.04 65.66,78.23 70.23,78.23 70.99,77.47 70.99,75.56 v2(70.87,75.44)
  Bottom Layer w0.254: v2(78.49,62.36) 78.49,67.82 v2(70.87,75.44)
R_INEN: length 20.9
  Top Layer w0.254: U2.17 52.08,29.46 49.91,29.46 48.51,30.86 48.51,34.8 52.96,39.24 57.66,39.24 JP1.2
R_INPH: length 22.2
  Top Layer w0.254: U2.15 50.73,30.8 49.66,31.88 49.66,34.16 53.34,37.85 61.34,37.85 JP1.4
R_NFAULT: length 11.5
  Top Layer w0.254: U3.9 79.38,45.17 R6.1
R_PH: length 64.4
  Top Layer w0.254: U2.5 57.09,30.15 56.26,30.99 56.26,33.27 57.15,34.16 58.55,34.16 63.12,38.73 65.15,38.73 65.28,38.86 65.28,41.4 64.39,42.29 64.39,57.28 72.01,64.9 80.39,64.9 84.2,61.09 84.2,58.55 83.3,57.64 U3.15
R_SH1: length 21
  Top Layer w0.254: v2(84.45,66.8) 84.45,73.33 80.79,76.99 ; 83.06,60.96 82.42,60.96 81.79,60.32 81.79,59.36 U3.18
  Bottom Layer w0.254: v2(82.98,60.9) 82.98,61.21 84.12,62.35 84.12,66.47 v2(84.45,66.8)
R_SH2: length 21.4
  Top Layer w0.254: v2(77.22,62.36) 78.88,60.69 U3.23 ; Q3.4 69.47,75.44
  Bottom Layer w0.254: v2(69.47,75.44) 77.22,67.69 v2(77.22,62.36)
R_SN: length 12.2
  Top Layer w0.254: v2(81.03,66.8) 81.03,68.72 R10.1 ; U3.20 80.39,59.85 80.39,61.85 v2(80.9,62.36)
  Bottom Layer w0.254: v2(80.9,62.36) 80.9,66.67 v2(81.03,66.8)
R_SNSOUT: length 15
  Top Layer w0.254: U3.10 79.88,46.35 81.79,44.45 81.79,43.05 82.26,42.58 82.9,42.58
R_SP: length 35
  Top Layer w0.254: U3.21 79.88,61.47 79.5,61.85 79.5,62.23 v2(79.63,62.36) ; 67.72,80.18 78.84,80.18 79.02,80 ; v2(79.76,66.8) 79.76,68.95 R10.2 78.99,76.57 Q4.9
  Bottom Layer w0.254: v2(79.63,62.36) 79.63,66.67 v2(79.76,66.8)
$1N94: length 4.9
  Top Layer w0.254: U1.4 45.34,59.95 45.08,59.69 45.08,58.8 44.26,57.97 C3.1
$1N95: length 4
  Top Layer w0.254: C3.2 44.89,60.45 U1.3
$1N105: length 10.2
  Top Layer w0.254: v4(41.91,60.83) 41.84,60.9 38.61,60.9 ; U1.2 47.29,60.99 v7(44.94,60.99)
  Bottom Layer w0.254: v7(44.94,60.99) 43.69,62.23 42.8,62.23 41.91,61.34 v4(41.91,60.83)
$1N139: length 35.7
  Top Layer w0.254: U1.12 50.52,57.16 50.93,56.76 50.93,56.24 50.16,55.48 ; v4(45.36,39.18) 45.36,37.59 R8.1
  Bottom Layer w0.254: v4(45.36,39.18) 47.4,39.18 59.2,50.98 59.2,53.03 56.72,55.51 v4(50.17,55.51)
$1N238: length 23
  Bottom Layer w0.254: 46.1,82.93 46.1,83.44 45.85,83.69 43.94,83.69 43.56,83.31 ; 43.56,83.31 43.56,82.68 ; 43.56,83.31 43.18,83.69 42.55,83.69 39.75,80.9 35.56,80.9 30.86,85.6 30.86,88.69
$1N2225: length 37.4
  Top Layer w0.254: 47.23,61.52 44.49,61.52 42.73,59.76 38.75,59.76 ; 38.75,59.68 38.75,58.4 38.11,57.76 37.09,57.76 36.4,58.44 34.28,58.44 ; C7.1 31.95,66.84 D1.1
  Bottom Layer w0.254: 38.23,59.56 38.01,59.56 C7.1
$1N6642: length 18.6
  Top Layer w0.254: 80.97,55.8 80.97,55.6 81.3,55.27 81.3,52.4 81.72,51.97 81.72,50.95 v2(81.55,50.78) ; v2(74.18,45.84) 74.18,44.43 74.15,44.41
  Bottom Layer w0.254: v2(81.55,50.78) 77.99,50.78 77.98,50.8 74.17,46.99 74.17,44.2
$1N6643: length 5.3
  Top Layer w0.254: C14.2 76.22,58.72 77.62,58.72 U3.2
$1N6644: length 5.5
  Top Layer w0.254: U3.4 72.51,57.64 C11.1
$1N6647: length 30.8
  Top Layer w0.254: U3.1 74.03,62.8 C14.1 71.82,62.8 v2(71.76,62.74) ; C15.1 68.81,71.97 C12.1 76.2,70.17 D2.1
  Bottom Layer w0.254: v2(71.76,62.74) 71.76,68.58 v2(71.88,68.71)
$1N6664: length 5.7
  Top Layer w0.254: U3.3 77.62,58.22 72.85,58.22 C11.2
$1N6665: length 13.2
  Top Layer w0.254: 79.58,87.87 75.4,83.68 68.1,83.68
$1N13007: length 14.7
  Top Layer w0.254: 62.4,22.64 73.55,22.64 76.08,25.17

## Copper pours and planes (outline as drawn; the poured copper is in the pictures)
GND on Top Layer: 54.18,84.07 57.32,84.07 57.32,82.43 54.18,82.43
GND on Top Layer: 78.96,94.75 78.01,93.8 78.01,92.47 78.84,91.63 80.74,91.63 81.78,90.6 81.78,87.27 79.23,84.72 77.24,84.72 76.64,84.12 76.64,82.4 76.73,82.31 79.97,82.31 80,82.28 80,84.15 82.49,86.65 82.67,86.65 83.24,87.21 83.24,90.59 81.42,92.41 81.42,93.75 80.42,94.75
GND on Top Layer: 76.73,84.07 80.12,84.07 80.12,82.63 76.73,82.63
GND on Top Layer: 40.09,92.75 44.41,92.75 44.46,92.79 46.06,92.79 50.47,88.38 51.67,88.4 52.63,88.38 52.59,88.36 52.83,88.36 53.7,87.49 53.7,83.83 53.94,83.59 53.94,82.62 54.14,82.42 54.95,82.42 55.03,82.34 57.31,82.34 57.45,82.48 57.45,87.23 58.76,88.55 64.05,88.55 67.81,92.3 78.39,92.3 78.48,92.4 76.76,94.12 76.76,94.43 67.44,94.43 67.17,94.7 62.41,89.95 62.41,89.81 58.52,89.81 58.29,90.04 57.98,90.04 56.44,88.5 56.44,85.02 54.76,85.02 54.72,85.06 54.72,88.5 54.76,88.55 53.86,89.45 50.33,89.45 46.07,93.71 45.3,93.71 44.67,94.34 44.67,94.48 44.4,94.75 42.04,94.75 40.09,92.8
VBAT on Bottom Layer: 76.78,77.31 78.33,77.31 78.33,76.38 76.78,76.38
VBAT on Bottom Layer: 65.15,77.44 67.18,77.44 67.18,76.09 65.15,76.09
VBAT on Bottom Layer: 53.93,77.3 56.26,77.3 56.26,76 53.93,76
(no net) on Top Layer: 67.36,77.58 65.07,77.58 65.07,76.26
$1N238 on Top Layer: 44.53,83.52 46.28,83.52 46.28,82.42 44.53,82.42
$1N6665 on Top Layer: 65.23,84.14 68.47,84.14 68.47,82.39 65.23,82.39

Small or netless copper shapes (teardrops, artwork), in the pictures only: 3 on Top Layer
